# Altium project BEE-1012 PAY-EXP_V12.PrjPcb (part 4 of 4)

## Sheet 17_I2C_Sensor_OnBoard.SchDoc
size 420 x 297 mm; SheetNumber: 28; SheetTotal: 36
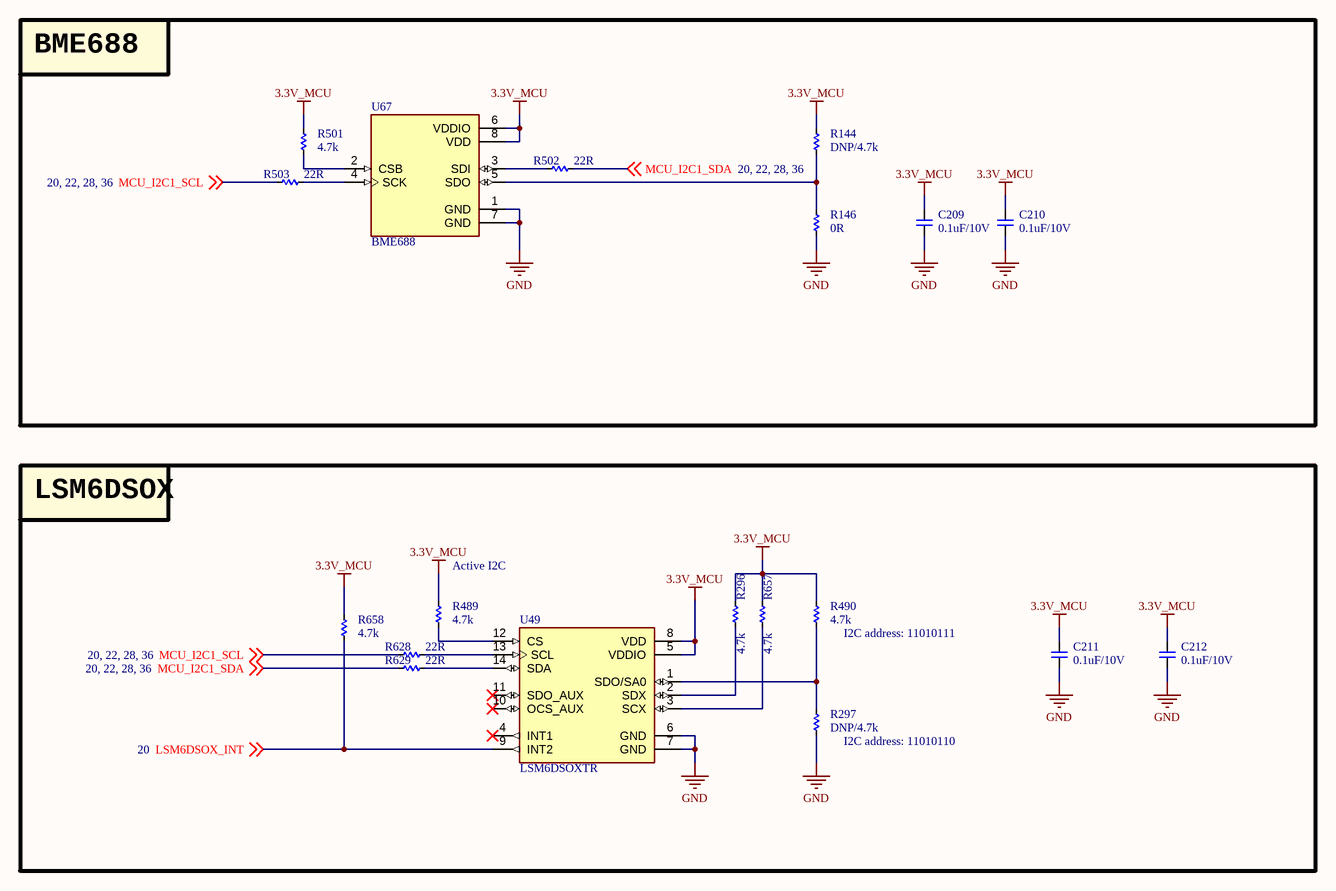
[diagram p28: 17_I2C_Sensor_OnBoard.SchDoc]

### Parts
(Parts that share a designator on the sheet are numbered #1, #2 ... from top to bottom, then left to right.)
C209  0.1uF/10V  [CAP_C_1005X60]
C210  0.1uF/10V  [CAP_C_1005X60]
C211  0.1uF/10V  [CAP_C_1005X60]
C212  0.1uF/10V  [CAP_C_1005X60]
R144#2  DNP/4.7k  [RES_C_1005X40]
R146#2  0R  [RES_C_1005X40]
R296  4.7k  [RES_C_1005X40]
R297  DNP/4.7k  [RES_C_1005X40]
R489  4.7k  [RES_C_1005X40]
R490  4.7k  [RES_C_1005X40]
R501  4.7k  [RES_C_1005X40]
R502  22R  [RES_C_1005X40]
R503  22R  [RES_C_1005X40]
R628  22R  [RES_C_1005X40]
R629  22R  [RES_C_1005X40]
R657  4.7k  [RES_C_1005X40]
R658  4.7k  [RES_C_1005X40]
U49  LSM6DSOXTR  [PQFN50P250X300X86-14N]
U67  BME688  [IC_BME688]

### Blocks framed on the sheet
BME688: C209 C210 R144#2 R146#2 R501-R503 U67
LSM6DSOX: C211 C212 R296 R297 R489 R490 R628 R629 R657 R658 U49

### Nets
3.3V_MCU: C209.2 C210.2 C211.2 C212.2 R144#2.1 R296.1 R489.1 R490.1 R501.1 R657.1 R658.1 U49.5(VDDIO) U49.8(VDD) U67.6(VDDIO) U67.8(VDD)
GND: C209.1 C210.1 C211.1 C212.1 R146#2.2 R297.2 U49.6(GND) U49.7(GND) U67.1(GND) U67.7(GND)
LSM6DSOX_INT: R658.2 U49.9(INT2) ; off-sheet LSM6DSOX_INT
MCU_I2C1_SCL: R503.1 R628.1 ; off-sheet MCU_I2C1_SCL
MCU_I2C1_SDA: R502.2 R629.1 ; off-sheet MCU_I2C1_SDA
NetR144#2_2: R144#2.2 R146#2.1 U67.5(SDO)
NetR296_2: R296.2 U49.2(SDX)
NetR297_1: R297.1 R490.2 U49.1(SDO/SA0)
NetR489_2: R489.2 U49.12(CS)
NetR501_2: R501.2 U67.2(CSB)
NetR502_1: R502.1 U67.3(SDI)
NetR503_2: R503.2 U67.4(SCK)
NetR628_2: R628.2 U49.13(SCL)
NetR629_2: R629.2 U49.14(SDA)
NetR657_2: R657.2 U49.3(SCX)

Not connected (* = marked no-connect by the designer): U49 4(INT1)* 10(OCS_AUX)* 11(SDO_AUX)*

### Notes on the sheet
- (near R489) Active I2C
- (near R490) I2C address: 11010111
- (near R297) I2C address: 11010110
- Project:
- Sub-system:
- Design by:
- Sheet title:
- Sheet
- of
- Checked by:
- Approved by:
- Revision:
- Document No:
- Size:
- Date:
- A3

### Library data of the parts
C209-C212 = _CAP_C_2: CAP
R144#2 R146#2 R296 R297 R489 R490 R501-R503 R628 R629 R657 R658 = _RES_B_2: RES
U49 = LSM6DSOXTR: Accelerometer, Gyroscope, 6 Axis Sensor I2C, SPI Output; MF: STMicroelectronics; SnapEDA_Link: https://www.snapeda.com/parts/LSM6DSOXTR/STMicroelectronics/view-part/?ref=snap; Package: VFLGA-14 STMicroelectronics; Value: *; MP: LSM6DSOXTR; Check_prices: https://www.snapeda.com/parts/LSM6DSOXTR/STMicroelectronics/view-part/?ref=eda
U67 = BME688: Gas sensor measuring relative humidity, barometric pressure, ambient temperature and gas (VOC); Package: None; MP: BME688; Price: None; Availability: Unavailable; Value: *

## Sheet 18_HD4_PUMP.SchDoc
size 420 x 297 mm; SheetNumber: 29; SheetTotal: 36
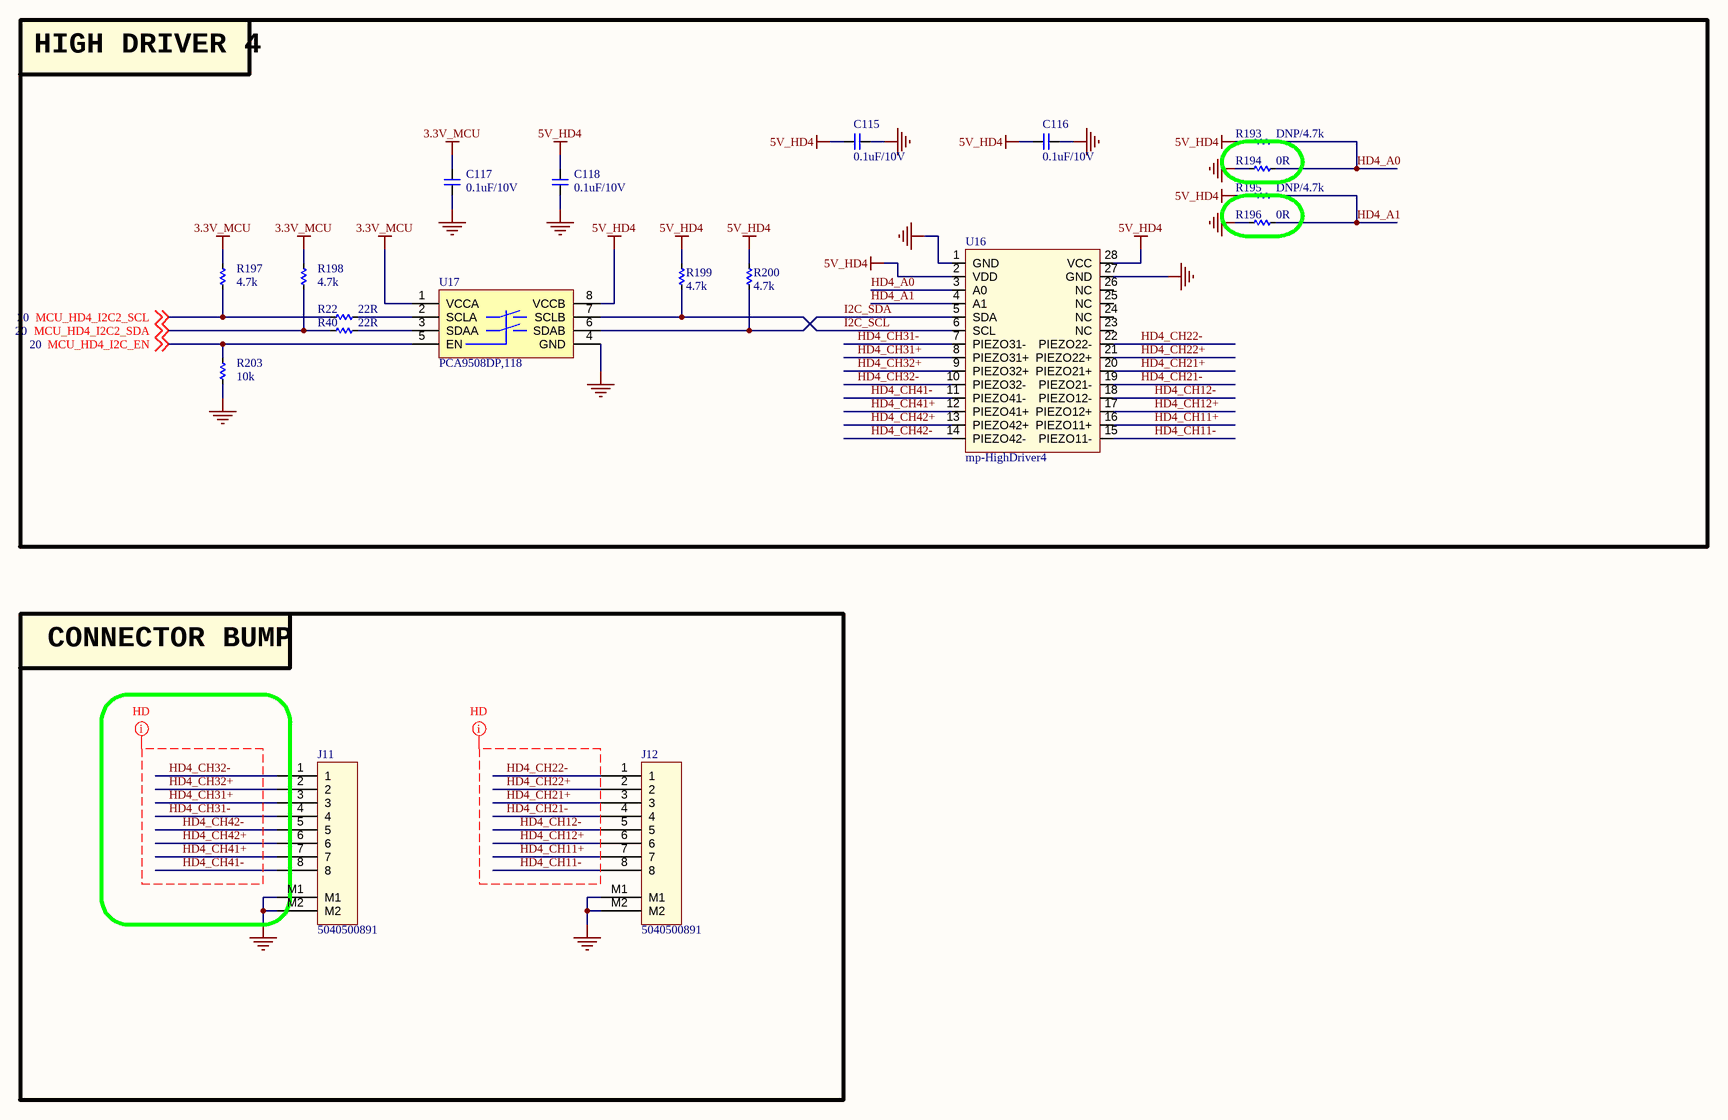
[diagram p29: 18_HD4_PUMP.SchDoc]

### Parts
C115  0.1uF/10V  [CAP_C_1005X60]
C116  0.1uF/10V  [CAP_C_1005X60]
C117  0.1uF/10V  [CAP_C_1005X60]
C118  0.1uF/10V  [CAP_C_1005X60]
J11  5040500891  [MOLEX_5040500891]
J12  5040500891  [MOLEX_5040500891]
R22  22R  [RES_C_1005X40]
R40  22R  [RES_C_1005X40]
R193  DNP/4.7k  [RES_C_1005X40]
R194  0R  [RES_C_1005X40]
R195  DNP/4.7k  [RES_C_1005X40]
R196  0R  [RES_C_1005X40]
R197  4.7k  [RES_C_1005X40]
R198  4.7k  [RES_C_1005X40]
R199  4.7k  [RES_C_1005X40]
R200  4.7k  [RES_C_1005X40]
R203  10k  [RES_C_1005X40]
U16  mp-HighDriver4  [MP_HIGHDRIVER4]
U17  PCA9508DP,118  [TSOP8]

### Blocks framed on the sheet
HIGH DRIVER 4: C115-C118 R22 R40 R193-R200 R203 U16 U17
CONNECTOR BUMP: J11 J12

### Nets
3.3V_MCU: C117.2 R197.1 R198.1 U17.1(VCCA)
5V_HD4: C115.2 C116.2 C118.2 R193.1 R195.1 R199.1 R200.1 U16.2(VDD) U16.28(VCC) U17.8(VCCB)
GND: C115.1 C116.1 C117.1 C118.1 J11.M1 J11.M2 J12.M1 J12.M2 R194.1 R196.1 R203.2 U16.1(GND) U16.27(GND) U17.4(GND)
HD4_A0: R193.2 R194.2 U16.3(A0)
HD4_A1: R195.2 R196.2 U16.4(A1)
HD4_CH11+: J12.7 U16.16(PIEZO11+)
HD4_CH11-: J12.8 U16.15(PIEZO11-)
HD4_CH12+: J12.6 U16.17(PIEZO12+)
HD4_CH12-: J12.5 U16.18(PIEZO12-)
HD4_CH21+: J12.3 U16.20(PIEZO21+)
HD4_CH21-: J12.4 U16.19(PIEZO21-)
HD4_CH22+: J12.2 U16.21(PIEZO22+)
HD4_CH22-: J12.1 U16.22(PIEZO22-)
HD4_CH31+: J11.3 U16.8(PIEZO31+)
HD4_CH31-: J11.4 U16.7(PIEZO31-)
HD4_CH32+: J11.2 U16.9(PIEZO32+)
HD4_CH32-: J11.1 U16.10(PIEZO32-)
HD4_CH41+: J11.7 U16.12(PIEZO41+)
HD4_CH41-: J11.8 U16.11(PIEZO41-)
HD4_CH42+: J11.6 U16.13(PIEZO42+)
HD4_CH42-: J11.5 U16.14(PIEZO42-)
I2C_SCL: R199.2 U16.6(SCL) U17.7(SCLB)
I2C_SDA: R200.2 U16.5(SDA) U17.6(SDAB)
MCU_HD4_I2C2_SCL: R22.1 R197.2 ; off-sheet MCU_HD4_I2C2_SCL
MCU_HD4_I2C2_SDA: R40.1 R198.2 ; off-sheet MCU_HD4_I2C2_SDA
MCU_HD4_I2C_EN: R203.1 U17.5(EN) ; off-sheet MCU_HD4_I2C_EN
NetR22_2: R22.2 U17.2(SCLA)
NetR40_2: R40.2 U17.3(SDAA)

Not connected (* = marked no-connect by the designer): U16 23(NC) 24(NC) 25(NC) 26(NC)

### Layout directives
net class HD: HD4_CH11+, HD4_CH11-, HD4_CH12+, HD4_CH12-, HD4_CH21+, HD4_CH21-, HD4_CH22+, HD4_CH22-, HD4_CH31+, HD4_CH31-, HD4_CH32+, HD4_CH32-, HD4_CH41+, HD4_CH41-, HD4_CH42+, HD4_CH42-

### Notes on the sheet
- Project:
- Sub-system:
- Design by:
- Sheet title:
- Sheet
- of
- Checked by:
- Approved by:
- Revision:
- Document No:
- Size:
- Date:
- A3

### Library data of the parts
C115-C118 = _CAP_C_2: CAP
J11 J12 = Header 8x1_2M
R22 R40 R193-R200 R203 = _RES_B_2: RES
U16 = mp_HighDriver4

## Sheet 18_HD4_PUMP_2.SchDoc
size 420 x 297 mm; SheetNumber: 30; SheetTotal: 36
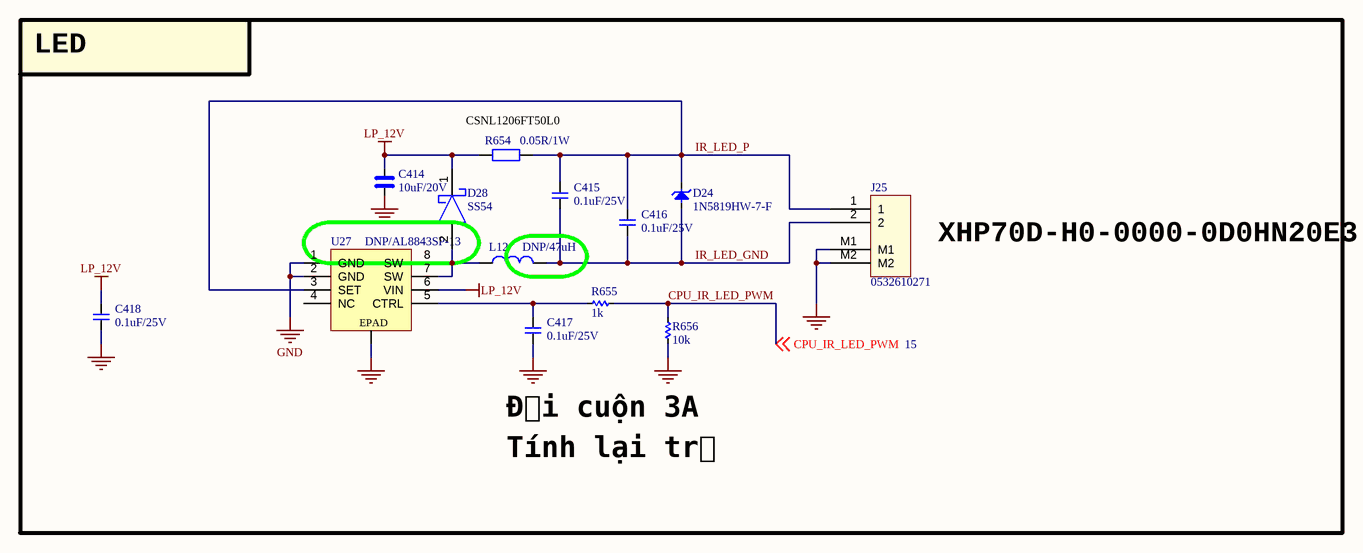
[diagram p30: 18_HD4_PUMP_2.SchDoc]

### Parts
C414  10uF/20V  [CAP_C_2012X110]
C415  0.1uF/25V  [CAP_C_1608X80]
C416  0.1uF/25V  [CAP_C_1608X80]
C417  0.1uF/25V  [CAP_C_1608X80]
C418  0.1uF/25V  [CAP_C_1608X80]
D24  1N5819HW-7-F  [SOD3717X145N]
D28  SS54  [DO-214AC_SMA]
J25  0532610271  [MOLEX_5040500291]
L12  DNP/47uH  [IND_MP_1250x1250x850]
R654  0.05R/1W  [RES_C_3216X70]
R655  1k  [RES_C_1608X60]
R656  10k  [RES_C_1608X60]
U27  DNP/AL8843SP-13  [SOIC127P602X173-8N_EPAD]

### Nets
GND: C414.2 C417.1 C418.1 J25.M1 J25.M2 R656.2 U27.1(GND) U27.2(GND) U27.9(EPAD)
LP_12V: C414.1 C418.2 D28.1 R654.1 U27.6(VIN)
CPU_IR_LED_PWM: R655.2 R656.1 ; off-sheet CPU_IR_LED_PWM
IR_LED_GND: C415.1 C416.1 D24.2(A) J25.2 L12.2
IR_LED_P: C415.2 C416.2 D24.1(K) J25.1 R654.2 U27.3(SET)
NetC417_2: C417.2 R655.1 U27.5(CTRL)
NetD28_2: D28.2 L12.1 U27.7(SW) U27.8(SW)

Not connected (* = marked no-connect by the designer): U27 4(NC)

### Notes on the sheet
- LED
- (near R654) CSNL1206FT50L0
- XHP70D-H0-0000-0D0HN20E3
- Đổi cuộn 3A
- Tính lại trở
- Project:
- Sub-system:
- Design by:
- Sheet title:
- Sheet
- of
- Checked by:
- Approved by:
- Revision:
- Document No:
- Size:
- Date:
- A3

### Library data of the parts
C414 = _CAP_C_High_2: CAP High Value
C415-C418 = _CAP_C_2: CAP
D24 = DIODE Zener: Zenner
D28 = SS54: DIODE SCHOTTKY 60V 3A DO214AA
J25 = Header 2x1_2M
L12 = L-SMD-1: B82477P4473M000; partNo: 78477010; Manufacturer: Wurth Elektronik; Inductance: 1.0 μH; ComponentLink1Description: Manufacturer; ComponentLink1URL: http://www.we-online.de; Created by: Baojun Chen; Created Date: Nov.2015; ComponentLink2Description: Datasheet; ComponentLink2URL: http://katalog.we-online.de/pbs/datasheet/78477010.pdf
R654 = _RES: RES; Chung_Loai: Dán; Don_Vi: Con; So_Chan: 2; Ten_Linh_Kien: Trở 0603 1% 10k; Ma_Hang: MH006333; Kieu_Chan: *
R655 R656 = _RES_B_2: RES
U27 = AL8843SP-13: IC LED DRIVER RGLTR PWM 3A 8SO

## Sheet 19_SOLENOID_HB_1.SchDoc
size 420 x 297 mm; SheetNumber: 31; SheetTotal: 36
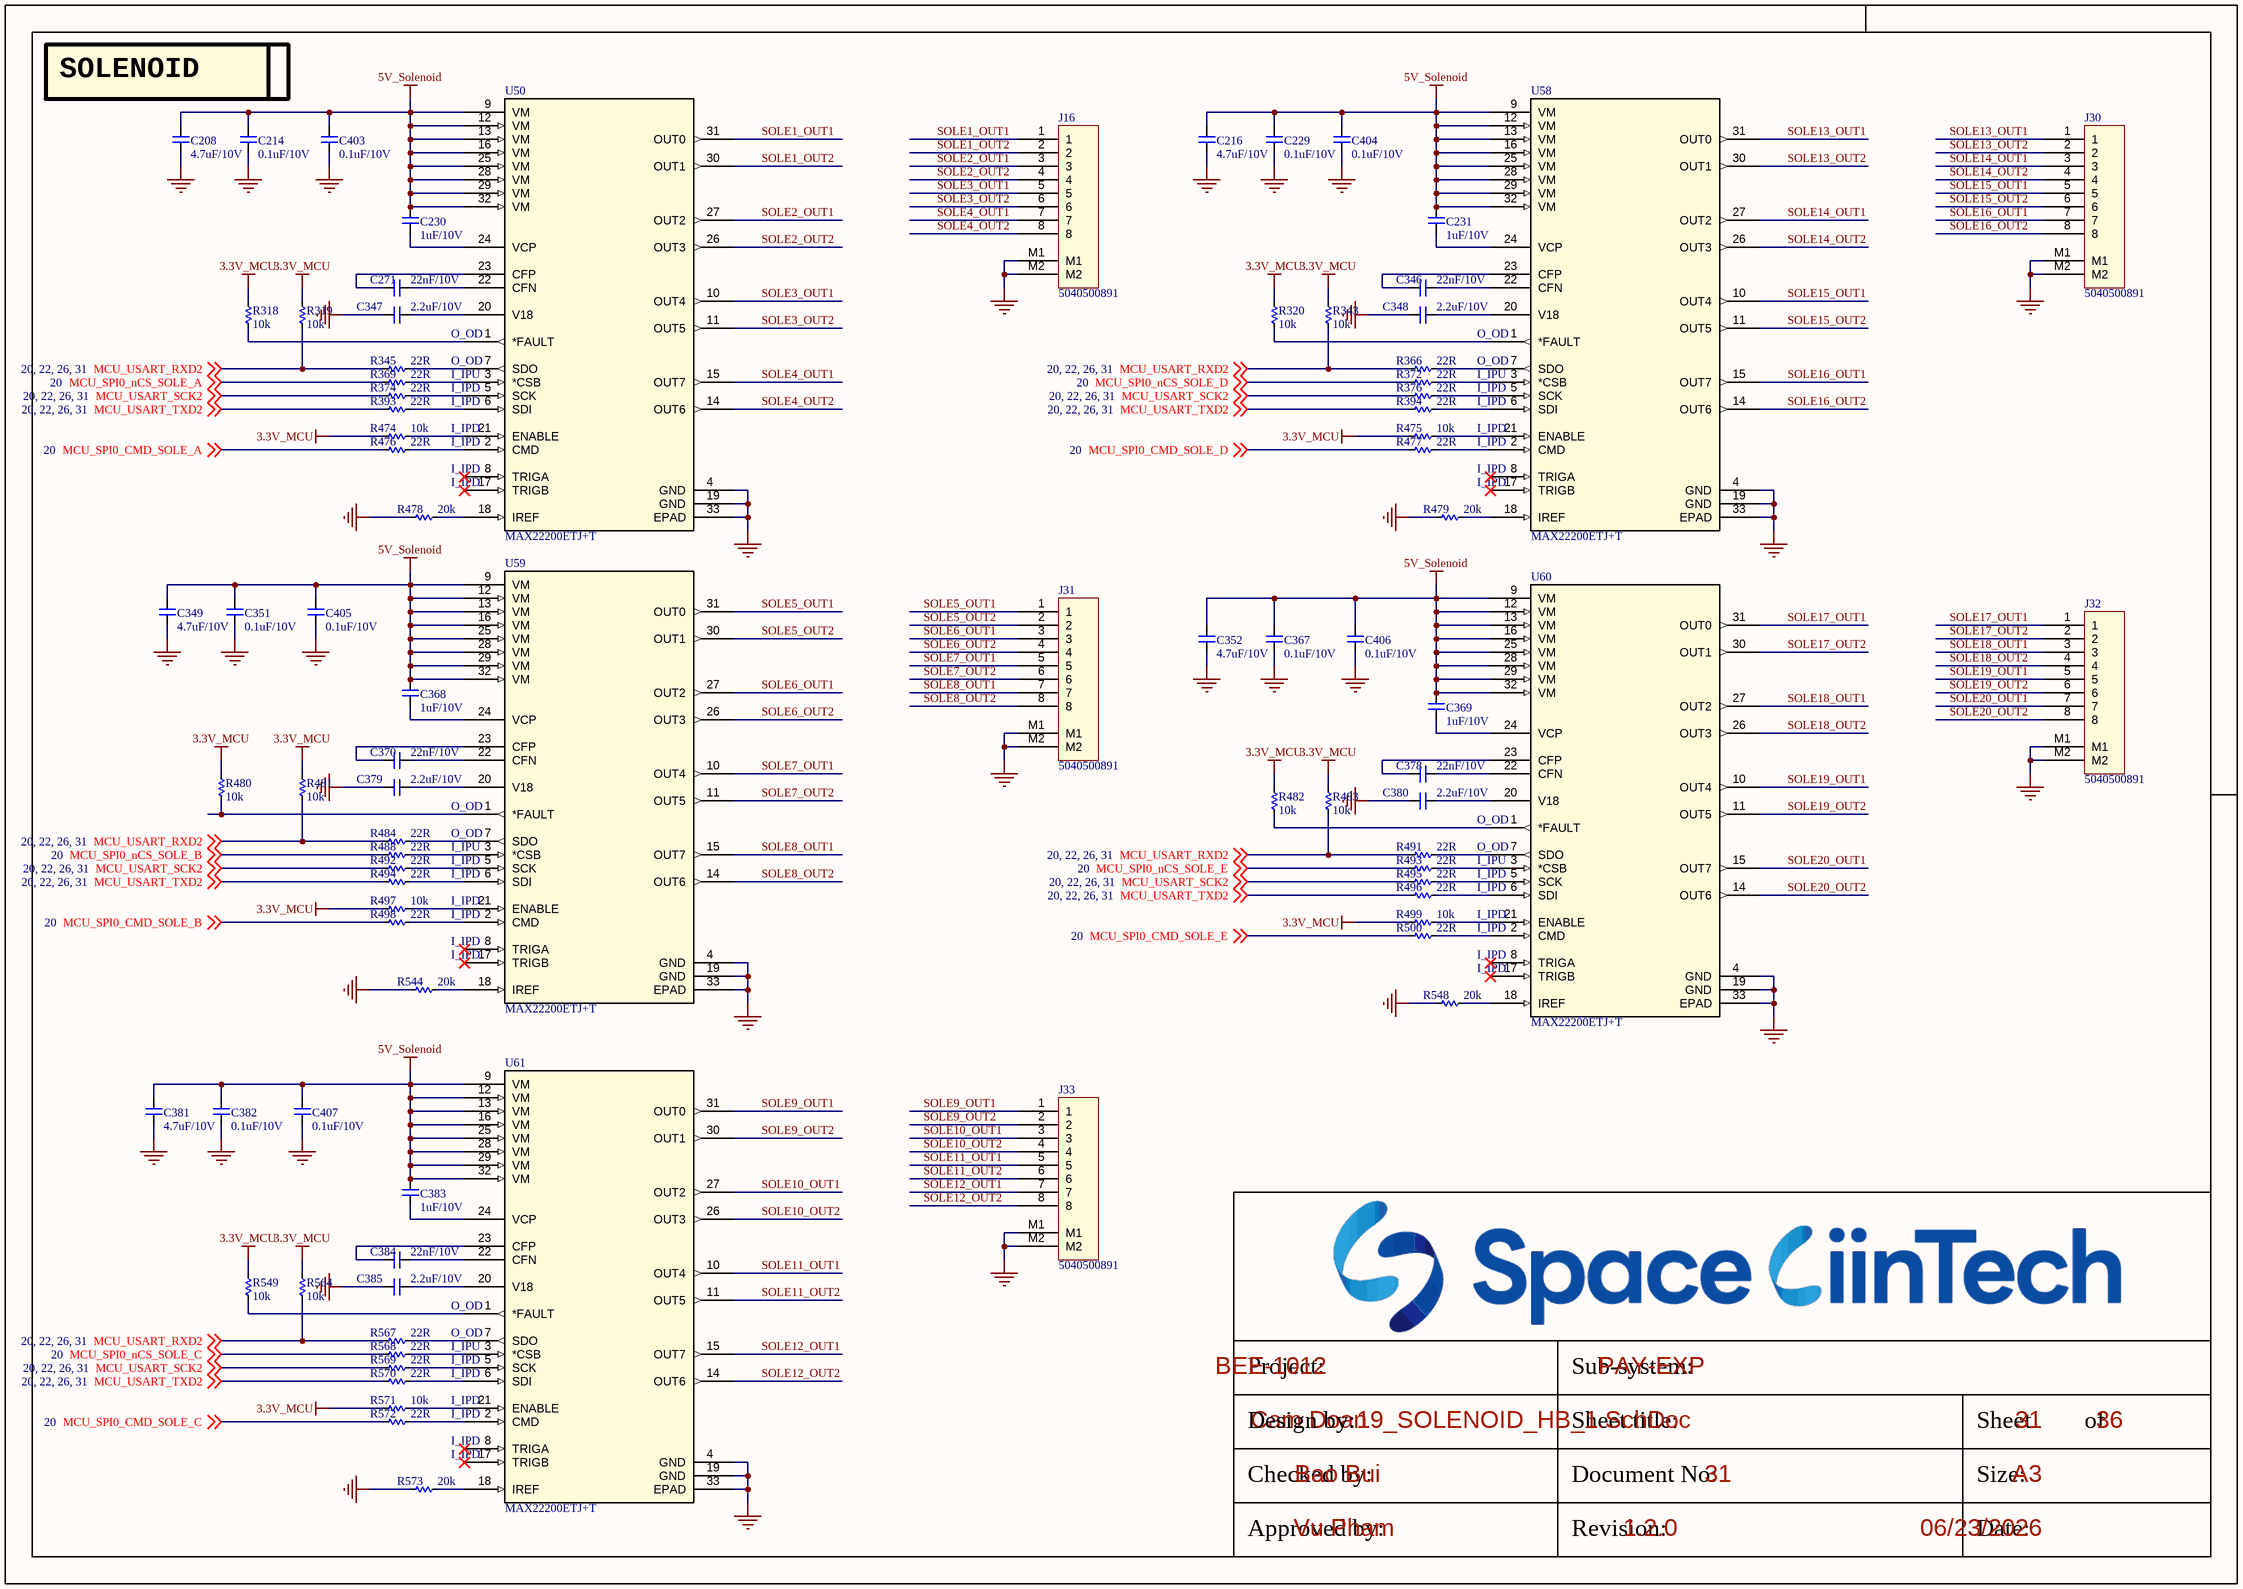
[diagram p31: 19_SOLENOID_HB_1.SchDoc]

### Parts
C208  4.7uF/10V  [CAP_C_1005X60]
C214  0.1uF/10V  [CAP_C_1005X60]
C216  4.7uF/10V  [CAP_C_1005X60]
C229  0.1uF/10V  [CAP_C_1005X60]
C230  1uF/10V  [CAP_C_1005X60]
C231  1uF/10V  [CAP_C_1005X60]
C271  22nF/10V  [CAP_C_1005X60]
C346  22nF/10V  [CAP_C_1005X60]
C347  2.2uF/10V  [CAP_C_1005X60]
C348  2.2uF/10V  [CAP_C_1005X60]
C349  4.7uF/10V  [CAP_C_1005X60]
C351  0.1uF/10V  [CAP_C_1005X60]
C352  4.7uF/10V  [CAP_C_1005X60]
C367  0.1uF/10V  [CAP_C_1005X60]
C368  1uF/10V  [CAP_C_1005X60]
C369  1uF/10V  [CAP_C_1005X60]
C370  22nF/10V  [CAP_C_1005X60]
C378  22nF/10V  [CAP_C_1005X60]
C379  2.2uF/10V  [CAP_C_1005X60]
C380  2.2uF/10V  [CAP_C_1005X60]
C381  4.7uF/10V  [CAP_C_1005X60]
C382  0.1uF/10V  [CAP_C_1005X60]
C383  1uF/10V  [CAP_C_1005X60]
C384  22nF/10V  [CAP_C_1005X60]
C385  2.2uF/10V  [CAP_C_1005X60]
C403  0.1uF/10V  [CAP_C_1005X60]
C404  0.1uF/10V  [CAP_C_1005X60]
C405  0.1uF/10V  [CAP_C_1005X60]
C406  0.1uF/10V  [CAP_C_1005X60]
C407  0.1uF/10V  [CAP_C_1005X60]
J16  5040500891  [MOLEX_5040500891]
J30  5040500891  [MOLEX_5040500891]
J31  5040500891  [MOLEX_5040500891]
J32  5040500891  [MOLEX_5040500891]
J33  5040500891  [MOLEX_5040500891]
R318  10k  [RES_C_1005X40]
R319  10k  [RES_C_1005X40]
R320  10k  [RES_C_1005X40]
R343  10k  [RES_C_1005X40]
R345  22R  [RES_C_1005X40]
R366  22R  [RES_C_1005X40]
R369  22R  [RES_C_1005X40]
R372  22R  [RES_C_1005X40]
R374  22R  [RES_C_1005X40]
R376  22R  [RES_C_1005X40]
R393  22R  [RES_C_1005X40]
R394  22R  [RES_C_1005X40]
R474  10k  [RES_C_1005X40]
R475  10k  [RES_C_1005X40]
R476  22R  [RES_C_1005X40]
R477  22R  [RES_C_1005X40]
R478  20k  [RES_C_1005X40]
R479  20k  [RES_C_1005X40]
R480  10k  [RES_C_1005X40]
R481  10k  [RES_C_1005X40]
R482  10k  [RES_C_1005X40]
R483  10k  [RES_C_1005X40]
R484  22R  [RES_C_1005X40]
R488  22R  [RES_C_1005X40]
R491  22R  [RES_C_1005X40]
R492  22R  [RES_C_1005X40]
R493  22R  [RES_C_1005X40]
R494  22R  [RES_C_1005X40]
R495  22R  [RES_C_1005X40]
R496  22R  [RES_C_1005X40]
R497  10k  [RES_C_1005X40]
R498  22R  [RES_C_1005X40]
R499  10k  [RES_C_1005X40]
R500  22R  [RES_C_1005X40]
R544  20k  [RES_C_1005X40]
R548  20k  [RES_C_1005X40]
R549  10k  [RES_C_1005X40]
R564  10k  [RES_C_1005X40]
R567  22R  [RES_C_1005X40]
R568  22R  [RES_C_1005X40]
R569  22R  [RES_C_1005X40]
R570  22R  [RES_C_1005X40]
R571  10k  [RES_C_1005X40]
R572  22R  [RES_C_1005X40]
R573  20k  [RES_C_1005X40]
U50  MAX22200ETJ+T  [21-0140AK_T3255_8C_MXM]
U58  MAX22200ETJ+T  [21-0140AK_T3255_8C_MXM]
U59  MAX22200ETJ+T  [21-0140AK_T3255_8C_MXM]
U60  MAX22200ETJ+T  [21-0140AK_T3255_8C_MXM]
U61  MAX22200ETJ+T  [21-0140AK_T3255_8C_MXM]

### Nets
3.3V_MCU: R318.1 R319.1 R320.1 R343.1 R474.1 R475.1 R480.1 R481.1 R482.1 R483.1 R497.1 R499.1 R549.1 R564.1 R571.1
5V_Solenoid: C208.2 C214.2 C216.2 C229.2 C230.2 C231.2 C349.2 C351.2 C352.2 C367.2 C368.2 C369.2 C381.2 C382.2 C383.2 C403.2 C404.2 C405.2 C406.2 C407.2 U50.9(VM) U50.12(VM) U50.13(VM) U50.16(VM) U50.25(VM) U50.28(VM) U50.29(VM) U50.32(VM) U58.9(VM) U58.12(VM) U58.13(VM) U58.16(VM) U58.25(VM) U58.28(VM) U58.29(VM) U58.32(VM) U59.9(VM) U59.12(VM) U59.13(VM) U59.16(VM) U59.25(VM) U59.28(VM) U59.29(VM) U59.32(VM) U60.9(VM) U60.12(VM) U60.13(VM) U60.16(VM) U60.25(VM) U60.28(VM) U60.29(VM) U60.32(VM) U61.9(VM) U61.12(VM) U61.13(VM) U61.16(VM) U61.25(VM) U61.28(VM) U61.29(VM) U61.32(VM)
GND: C208.1 C214.1 C216.1 C229.1 C347.1 C348.1 C349.1 C351.1 C352.1 C367.1 C379.1 C380.1 C381.1 C382.1 C385.1 C403.1 C404.1 C405.1 C406.1 C407.1 J16.M1 J16.M2 J30.M1 J30.M2 J31.M1 J31.M2 J32.M1 J32.M2 J33.M1 J33.M2 R478.1 R479.1 R544.1 R548.1 R573.1 U50.4(GND) U50.19(GND) U50.33(EPAD) U58.4(GND) U58.19(GND) U58.33(EPAD) U59.4(GND) U59.19(GND) U59.33(EPAD) U60.4(GND) U60.19(GND) U60.33(EPAD) U61.4(GND) U61.19(GND) U61.33(EPAD)
MCU_SPI0_CMD_SOLE_A: R476.1 ; off-sheet MCU_SPI0_CMD_SOLE_A
MCU_SPI0_CMD_SOLE_B: R498.1 ; off-sheet MCU_SPI0_CMD_SOLE_B
MCU_SPI0_CMD_SOLE_C: R572.1 ; off-sheet MCU_SPI0_CMD_SOLE_C
MCU_SPI0_CMD_SOLE_D: R477.1 ; off-sheet MCU_SPI0_CMD_SOLE_D
MCU_SPI0_CMD_SOLE_E: R500.1 ; off-sheet MCU_SPI0_CMD_SOLE_E
MCU_SPI0_nCS_SOLE_A: R369.1 ; off-sheet MCU_SPI0_nCS_SOLE_A
MCU_SPI0_nCS_SOLE_B: R488.1 ; off-sheet MCU_SPI0_nCS_SOLE_B
MCU_SPI0_nCS_SOLE_C: R568.1 ; off-sheet MCU_SPI0_nCS_SOLE_C
MCU_SPI0_nCS_SOLE_D: R372.1 ; off-sheet MCU_SPI0_nCS_SOLE_D
MCU_SPI0_nCS_SOLE_E: R493.1 ; off-sheet MCU_SPI0_nCS_SOLE_E
MCU_USART_RXD2: R319.2 R343.2 R345.1 R366.1 R481.2 R483.2 R484.1 R491.1 R564.2 R567.1 ; off-sheet MCU_USART_RXD2
MCU_USART_SCK2: R374.1 R376.1 R492.1 R495.1 R569.1 ; off-sheet MCU_USART_SCK2
MCU_USART_TXD2: R393.1 R394.1 R494.1 R496.1 R570.1 ; off-sheet MCU_USART_TXD2
SOLE1_OUT1: J16.1 U50.31(OUT0)
SOLE1_OUT2: J16.2 U50.30(OUT1)
SOLE2_OUT1: J16.3 U50.27(OUT2)
SOLE2_OUT2: J16.4 U50.26(OUT3)
SOLE3_OUT1: J16.5 U50.10(OUT4)
SOLE3_OUT2: J16.6 U50.11(OUT5)
SOLE4_OUT1: J16.7 U50.15(OUT7)
SOLE4_OUT2: J16.8 U50.14(OUT6)
SOLE5_OUT1: J31.1 U59.31(OUT0)
SOLE5_OUT2: J31.2 U59.30(OUT1)
SOLE6_OUT1: J31.3 U59.27(OUT2)
SOLE6_OUT2: J31.4 U59.26(OUT3)
SOLE7_OUT1: J31.5 U59.10(OUT4)
SOLE7_OUT2: J31.6 U59.11(OUT5)
SOLE8_OUT1: J31.7 U59.15(OUT7)
SOLE8_OUT2: J31.8 U59.14(OUT6)
SOLE9_OUT1: J33.1 U61.31(OUT0)
SOLE9_OUT2: J33.2 U61.30(OUT1)
SOLE10_OUT1: J33.3 U61.27(OUT2)
SOLE10_OUT2: J33.4 U61.26(OUT3)
SOLE11_OUT1: J33.5 U61.10(OUT4)
SOLE11_OUT2: J33.6 U61.11(OUT5)
SOLE12_OUT1: J33.7 U61.15(OUT7)
SOLE12_OUT2: J33.8 U61.14(OUT6)
SOLE13_OUT1: J30.1 U58.31(OUT0)
SOLE13_OUT2: J30.2 U58.30(OUT1)
SOLE14_OUT1: J30.3 U58.27(OUT2)
SOLE14_OUT2: J30.4 U58.26(OUT3)
SOLE15_OUT1: J30.5 U58.10(OUT4)
SOLE15_OUT2: J30.6 U58.11(OUT5)
SOLE16_OUT1: J30.7 U58.15(OUT7)
SOLE16_OUT2: J30.8 U58.14(OUT6)
SOLE17_OUT1: J32.1 U60.31(OUT0)
SOLE17_OUT2: J32.2 U60.30(OUT1)
SOLE18_OUT1: J32.3 U60.27(OUT2)
SOLE18_OUT2: J32.4 U60.26(OUT3)
SOLE19_OUT1: J32.5 U60.10(OUT4)
SOLE19_OUT2: J32.6 U60.11(OUT5)
SOLE20_OUT1: J32.7 U60.15(OUT7)
SOLE20_OUT2: J32.8 U60.14(OUT6)
NetC230_1: C230.1 U50.24(VCP)
NetC231_1: C231.1 U58.24(VCP)
NetC271_1: C271.1 U50.22(CFN)
NetC271_2: C271.2 U50.23(CFP)
NetC346_1: C346.1 U58.22(CFN)
NetC346_2: C346.2 U58.23(CFP)
NetC347_2: C347.2 U50.20(V18)
NetC348_2: C348.2 U58.20(V18)
NetC368_1: C368.1 U59.24(VCP)
NetC369_1: C369.1 U60.24(VCP)
NetC370_1: C370.1 U59.22(CFN)
NetC370_2: C370.2 U59.23(CFP)
NetC378_1: C378.1 U60.22(CFN)
NetC378_2: C378.2 U60.23(CFP)
NetC379_2: C379.2 U59.20(V18)
NetC380_2: C380.2 U60.20(V18)
NetC383_1: C383.1 U61.24(VCP)
NetC384_1: C384.1 U61.22(CFN)
NetC384_2: C384.2 U61.23(CFP)
NetC385_2: C385.2 U61.20(V18)
NetR318_2: R318.2 U50.1(*FAULT)
NetR320_2: R320.2 U58.1(*FAULT)
NetR345_2: R345.2 U50.7(SDO)
NetR366_2: R366.2 U58.7(SDO)
NetR369_2: R369.2 U50.3(*CSB)
NetR372_2: R372.2 U58.3(*CSB)
NetR374_2: R374.2 U50.5(SCK)
NetR376_2: R376.2 U58.5(SCK)
NetR393_2: R393.2 U50.6(SDI)
NetR394_2: R394.2 U58.6(SDI)
NetR474_2: R474.2 U50.21(ENABLE)
NetR475_2: R475.2 U58.21(ENABLE)
NetR476_2: R476.2 U50.2(CMD)
NetR477_2: R477.2 U58.2(CMD)
NetR478_2: R478.2 U50.18(IREF)
NetR479_2: R479.2 U58.18(IREF)
NetR480_2: R480.2 U59.1(*FAULT)
NetR482_2: R482.2 U60.1(*FAULT)
NetR484_2: R484.2 U59.7(SDO)
NetR488_2: R488.2 U59.3(*CSB)
NetR491_2: R491.2 U60.7(SDO)
NetR492_2: R492.2 U59.5(SCK)
NetR493_2: R493.2 U60.3(*CSB)
NetR494_2: R494.2 U59.6(SDI)
NetR495_2: R495.2 U60.5(SCK)
NetR496_2: R496.2 U60.6(SDI)
NetR497_2: R497.2 U59.21(ENABLE)
NetR498_2: R498.2 U59.2(CMD)
NetR499_2: R499.2 U60.21(ENABLE)
NetR500_2: R500.2 U60.2(CMD)
NetR544_2: R544.2 U59.18(IREF)
NetR548_2: R548.2 U60.18(IREF)
NetR549_2: R549.2 U61.1(*FAULT)
NetR567_2: R567.2 U61.7(SDO)
NetR568_2: R568.2 U61.3(*CSB)
NetR569_2: R569.2 U61.5(SCK)
NetR570_2: R570.2 U61.6(SDI)
NetR571_2: R571.2 U61.21(ENABLE)
NetR572_2: R572.2 U61.2(CMD)
NetR573_2: R573.2 U61.18(IREF)

Not connected (* = marked no-connect by the designer): U50 8(TRIGA)* 17(TRIGB)*; U58 8(TRIGA)* 17(TRIGB)*; U59 8(TRIGA)* 17(TRIGB)*; U60 8(TRIGA)* 17(TRIGB)*; U61 8(TRIGA)* 17(TRIGB)*

### Notes on the sheet
- (near C208) SOLENOID
- O_OD
- (near U50) I_IPU
- (near U50) I_IPD
- (near U50) O_OD
- (near U58) I_IPU
- (near U58) I_IPD
- (near U58) O_OD
- I_IPD
- (near U59) I_IPU
- (near U59) I_IPD
- (near U59) O_OD
- (near U60) I_IPU
- (near U60) O_OD
- (near U60) I_IPD
- (near U61) O_OD
- (near U61) I_IPU
- (near U61) I_IPD
- Project:
- Sub-system:
- Design by:
- Sheet title:
- Sheet
- of
- Checked by:
- Approved by:
- Revision:
- Document No:
- Size:
- Date:
- A3

### Library data of the parts
C208 C214 C216 C229-C231 C271 C346-C349 C351 C352 C367-C370 C378-C385 C403-C407 = _CAP_C_2: CAP CHIP
J16 J30-J33 = Header 8x1_2M
R318-R320 R343 R345 R366 R369 R372 R374 R376 R393 R394 R474-R484 R488 R491-R500 R544 R548 R549 R564 R567-R573 = _RES_B_2: RES
U50 U58-U61 = MAX22200ETJ+T: 36V, 1A Octal Integrated Serial-Controlled Solenoid and Motor Driver; Manufacturer_Name: Analog Devices Inc; Copyright: Copyright (C) 2026 Ultra Librarian. All rights reserved.; Manufacturer_Part_Number: MAX22200ETJ+T; RefDes: RefDes; Type: Type

## Sheet 19_SOLENOID_OF.SchDoc
size 420 x 297 mm; SheetNumber: 33; SheetTotal: 36
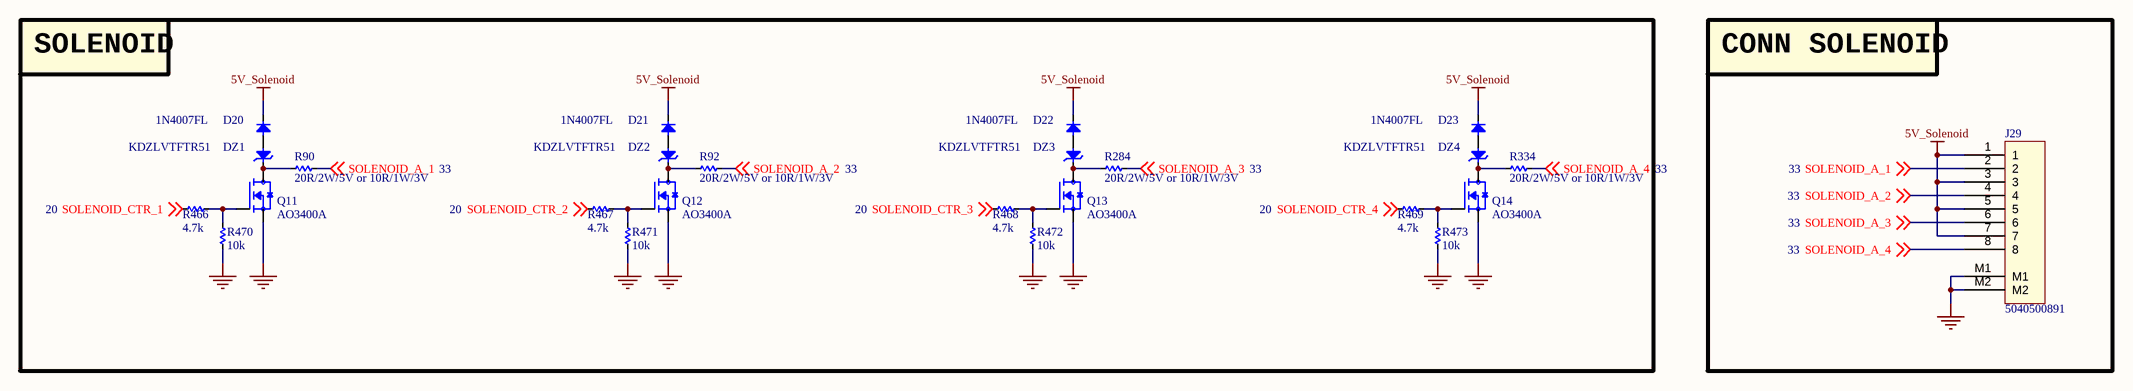
[diagram p32: 19_SOLENOID_OF.SchDoc]

### Parts
D20  1N4007FL  [SOD3717X145N]
D21  1N4007FL  [SOD3717X145N]
D22  1N4007FL  [SOD3717X145N]
D23  1N4007FL  [SOD3717X145N]
DZ1  KDZLVTFTR51  [SOD3717X145N]
DZ2  KDZLVTFTR51  [SOD3717X145N]
DZ3  KDZLVTFTR51  [SOD3717X145N]
DZ4  KDZLVTFTR51  [SOD3717X145N]
J29  5040500891  [MOLEX_5040500891]
Q11  AO3400A  [SOT95P240X120-3N]
Q12  AO3400A  [SOT95P240X120-3N]
Q13  AO3400A  [SOT95P240X120-3N]
Q14  AO3400A  [SOT95P240X120-3N]
R90  20R/2W/5V or 10R/1W/3V  [RES_C_6331X65_N]
R92  20R/2W/5V or 10R/1W/3V  [RES_C_6331X65_N]
R284  20R/2W/5V or 10R/1W/3V  [RES_C_6331X65_N]
R334  20R/2W/5V or 10R/1W/3V  [RES_C_6331X65_N]
R466  4.7k  [RES_C_1005X40]
R467  4.7k  [RES_C_1005X40]
R468  4.7k  [RES_C_1005X40]
R469  4.7k  [RES_C_1005X40]
R470  10k  [RES_C_1005X40]
R471  10k  [RES_C_1005X40]
R472  10k  [RES_C_1005X40]
R473  10k  [RES_C_1005X40]

### Blocks framed on the sheet
SOLENOID: D20-D23 DZ1-DZ4 Q11-Q14 R90 R92 R284 R334 R466-R473
CONN SOLENOID: J29

### Nets
5V_Solenoid: D20.1(K) D21.1(K) D22.1(K) D23.1(K) J29.1 J29.3 J29.5 J29.7
GND: J29.M1 J29.M2 Q11.2(S) Q12.2(S) Q13.2(S) Q14.2(S) R470.1 R471.1 R472.1 R473.1
SOLENOID_A_1: J29.2 R90.1 ; off-sheet SOLENOID_A_1
SOLENOID_A_2: J29.4 R92.1 ; off-sheet SOLENOID_A_2
SOLENOID_A_3: J29.6 R284.1 ; off-sheet SOLENOID_A_3
SOLENOID_A_4: J29.8 R334.1 ; off-sheet SOLENOID_A_4
SOLENOID_CTR_1: R466.2 ; off-sheet SOLENOID_CTR_1
SOLENOID_CTR_2: R467.2 ; off-sheet SOLENOID_CTR_2
SOLENOID_CTR_3: R468.2 ; off-sheet SOLENOID_CTR_3
SOLENOID_CTR_4: R469.2 ; off-sheet SOLENOID_CTR_4
NetD20_2: D20.2(A) DZ1.2(A)
NetD21_2: D21.2(A) DZ2.2(A)
NetD22_2: D22.2(A) DZ3.2(A)
NetD23_2: D23.2(A) DZ4.2(A)
NetDZ1_1: DZ1.1(K) Q11.3(D) R90.2
NetDZ2_1: DZ2.1(K) Q12.3(D) R92.2
NetDZ3_1: DZ3.1(K) Q13.3(D) R284.2
NetDZ4_1: DZ4.1(K) Q14.3(D) R334.2
NetQ11_1: Q11.1(G) R466.1 R470.2
NetQ12_1: Q12.1(G) R467.1 R471.2
NetQ13_1: Q13.1(G) R468.1 R472.2
NetQ14_1: Q14.1(G) R469.1 R473.2

### Notes on the sheet
- Project:
- Sub-system:
- Design by:
- Sheet title:
- Sheet
- of
- Checked by:
- Approved by:
- Revision:
- Document No:
- Size:
- Date:
- A3

### Library data of the parts
D20-D23 = Diode SMD: Default Diode; Code - JEDEC: DO-214-AB; Value: 1N5007; Published: 8-Jun-2000; Revision: July-2002: Re-released for DXP Platform.; Publisher: Altium Limited
DZ1-DZ4 = DIODE Zener: Zenner
J29 = Header 8x1_2M
Q11-Q14 = MOSFET_N: N-Channel 30 V 5.7A (Ta) 1.4W (Ta) Surface Mount SOT-23-3; MF: Alpha & Omega Semiconductor; SnapEDA_Link: https://www.snapeda.com/parts/AO3400A/Alpha/view-part/?ref=snap; Package: SOT-23 Alpha &amp; Omega Semiconductor Inc.; Value: *; MP: AO3400A; Check_prices: https://www.snapeda.com/parts/AO3400A/Alpha/view-part/?ref=eda
R90 R92 R284 R334 R466-R473 = _RES_B_2: RES

## Sheet 20_AI_Board.SchDoc
size 420 x 297 mm; SheetNumber: 33; SheetTotal: 36
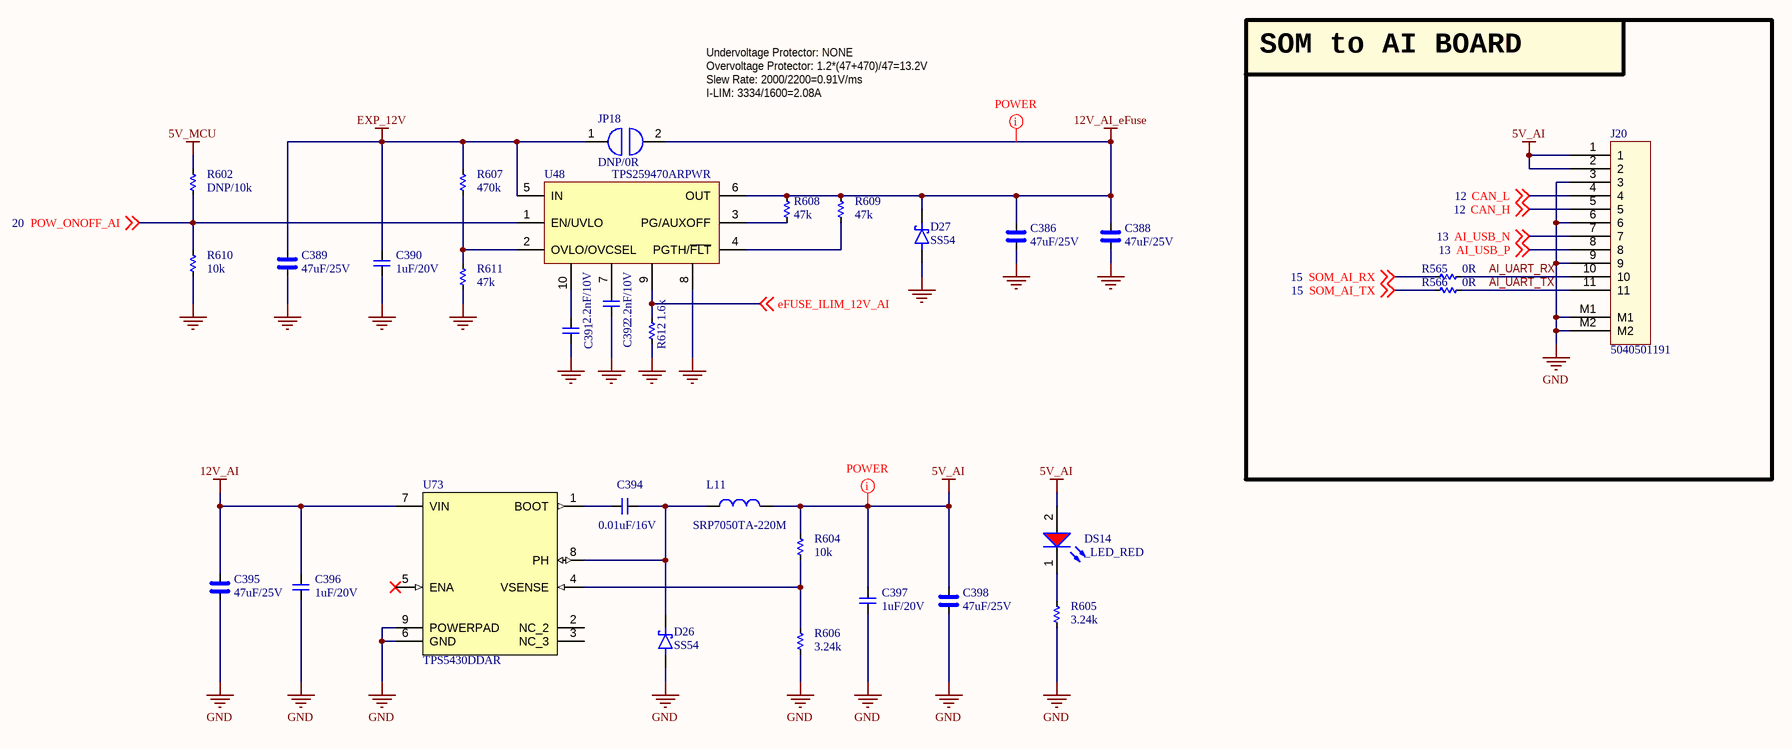
[diagram p33: 20_AI_Board.SchDoc]

### Parts
C386  47uF/25V  [CAP_C_3225X80]
C388  47uF/25V  [CAP_C_3225X80]
C389  47uF/25V  [CAP_C_3225X80]
C390  1uF/20V  [CAP_C_1005X60]
C391  2.2nF/10V  [CAP_C_1005X60]
C392  2.2nF/10V  [CAP_C_1005X60]
C394  0.01uF/16V  [CAP_C_1608X80]
C395  47uF/25V  [CAP_C_3225X80]
C396  1uF/20V  [CAP_C_1005X60]
C397  1uF/20V  [CAP_C_1005X60]
C398  47uF/25V  [CAP_C_3225X80]
D26  SS54  [DO-214AC_SMA]
D27  SS54  [DO-214AC_SMA]
DS14  _LED_RED  [LED_0603]
J20  5040501191  [MOLEX_5040501191]
JP18  DNP/0R  [JUMPER_1608]
L11  SRP7050TA-220M  [PSM6050]
R565  0R  [RES_C_1005X40]
R566  0R  [RES_C_1005X40]
R602  DNP/10k  [RES_C_1005X40]
R604  10k  [RES_C_1005X40]
R605  3.24k  [RES_C_1005X40]
R606  3.24k  [RES_C_1005X40]
R607  470k  [RES_C_1005X40]
R608  47k  [RES_C_1005X40]
R609  47k  [RES_C_1005X40]
R610  10k  [RES_C_1005X40]
R611  47k  [RES_C_1005X40]
R612  1.6k  [RES_C_1005X40]
U48  TPS259470ARPWR  [VQFN-HR-10]
U73  TPS5430DDAR  [TPS54531DDAR]

### Blocks framed on the sheet
SOM to AI BOARD: J20 R565 R566

### Nets
5V_AI: C397.2 C398.2 DS14.2(A) J20.1 J20.2 L11.2 R604.2
5V_MCU: R602.1
12V_AI: C395.2 C396.2 U73.7(VIN)
12V_AI_eFuse: C386.2 C388.2 D27.1(K) JP18.2 R608.2 R609.2 U48.6(OUT)
EXP_12V: C389.2 C390.2 JP18.1 R607.2 U48.5(IN)
GND: C386.1 C388.1 C389.1 C390.1 C391.1 C392.1 C395.1 C396.1 C397.1 C398.1 D26.2(A) D27.2(A) J20.3 J20.6 J20.9 J20.M1 J20.M2 R605.1 R606.1 R610.2 R611.1 R612.1 U48.8 U73.6(GND) U73.9(POWERPAD)
AI_UART_RX: J20.10 R565.2
AI_UART_TX: J20.11 R566.2
AI_USB_N: J20.7 ; off-sheet AI_USB_N  [project net USBB_N]
AI_USB_P: J20.8 ; off-sheet AI_USB_P  [project net USBB_P]
CAN_H: J20.5 ; off-sheet CAN_H
CAN_L: J20.4 ; off-sheet CAN_L
eFUSE_ILIM_12V_AI: R612.2 U48.9 ; off-sheet eFUSE_ILIM_12V_AI
POW_ONOFF_AI: R602.2 R610.1 U48.1(EN/UVLO) ; off-sheet POW_ONOFF_AI
SOM_AI_RX: R565.1 ; off-sheet SOM_AI_RX
SOM_AI_TX: R566.1 ; off-sheet SOM_AI_TX
NetC391_2: C391.2 U48.10
NetC392_2: C392.2 U48.7
NetC394_1: C394.1 D26.1(K) L11.1 U73.8(PH)
NetC394_2: C394.2 U73.1(BOOT)
NetDS14_1: DS14.1(K) R605.2
NetR604_1: R604.1 R606.2 U73.4(VSENSE)
NetR607_1: R607.1 R611.2 U48.2(OVLO/OVCSEL)
NetR608_1: R608.1 U48.3(PG/AUXOFF)
NetR609_1: R609.1 U48.4(PGTH/~{FLT})

Not connected (* = marked no-connect by the designer): U73 2(NC_2) 3(NC_3) 5(ENA)*

### Layout directives
net class POWER: 5V_AI, 12V_AI_eFuse

### Notes on the sheet
- Undervoltage Protector: NONE
- Overvoltage Protector: 1.2*(47+470)/47=13.2V
- Slew Rate: 2000/2200=0.91V/ms
- I-LIM: 3334/1600=2.08A
- Project:
- Sub-system:
- Design by:
- Sheet title:
- Sheet
- of
- Checked by:
- Approved by:
- Revision:
- Document No:
- Size:
- Date:
- A3

### Library data of the parts
C386 C388 C389 C395 C398 = _CAP_C_High_2: CAP High Value
C390-C392 C394 C396 C397 = _CAP_C_2: CAP
D26 D27 = DIODE SCHOTTKY
J20 = Header 11x1_2M
JP18 = JUMPER
L11 = SRP7050TA-220M: FIXED IND 22UH 2.5A 170 MOHM SMD
R565 R566 R602 R604-R612 = _RES_B_2: RES
U73 = TPS5430DDAR: IC REG BUCK ADJ 3A 8SOPWR

## Sheet 21_POWER_PWR_SEN.SchDoc
size 420 x 297 mm; SheetNumber: 34; SheetTotal: 36
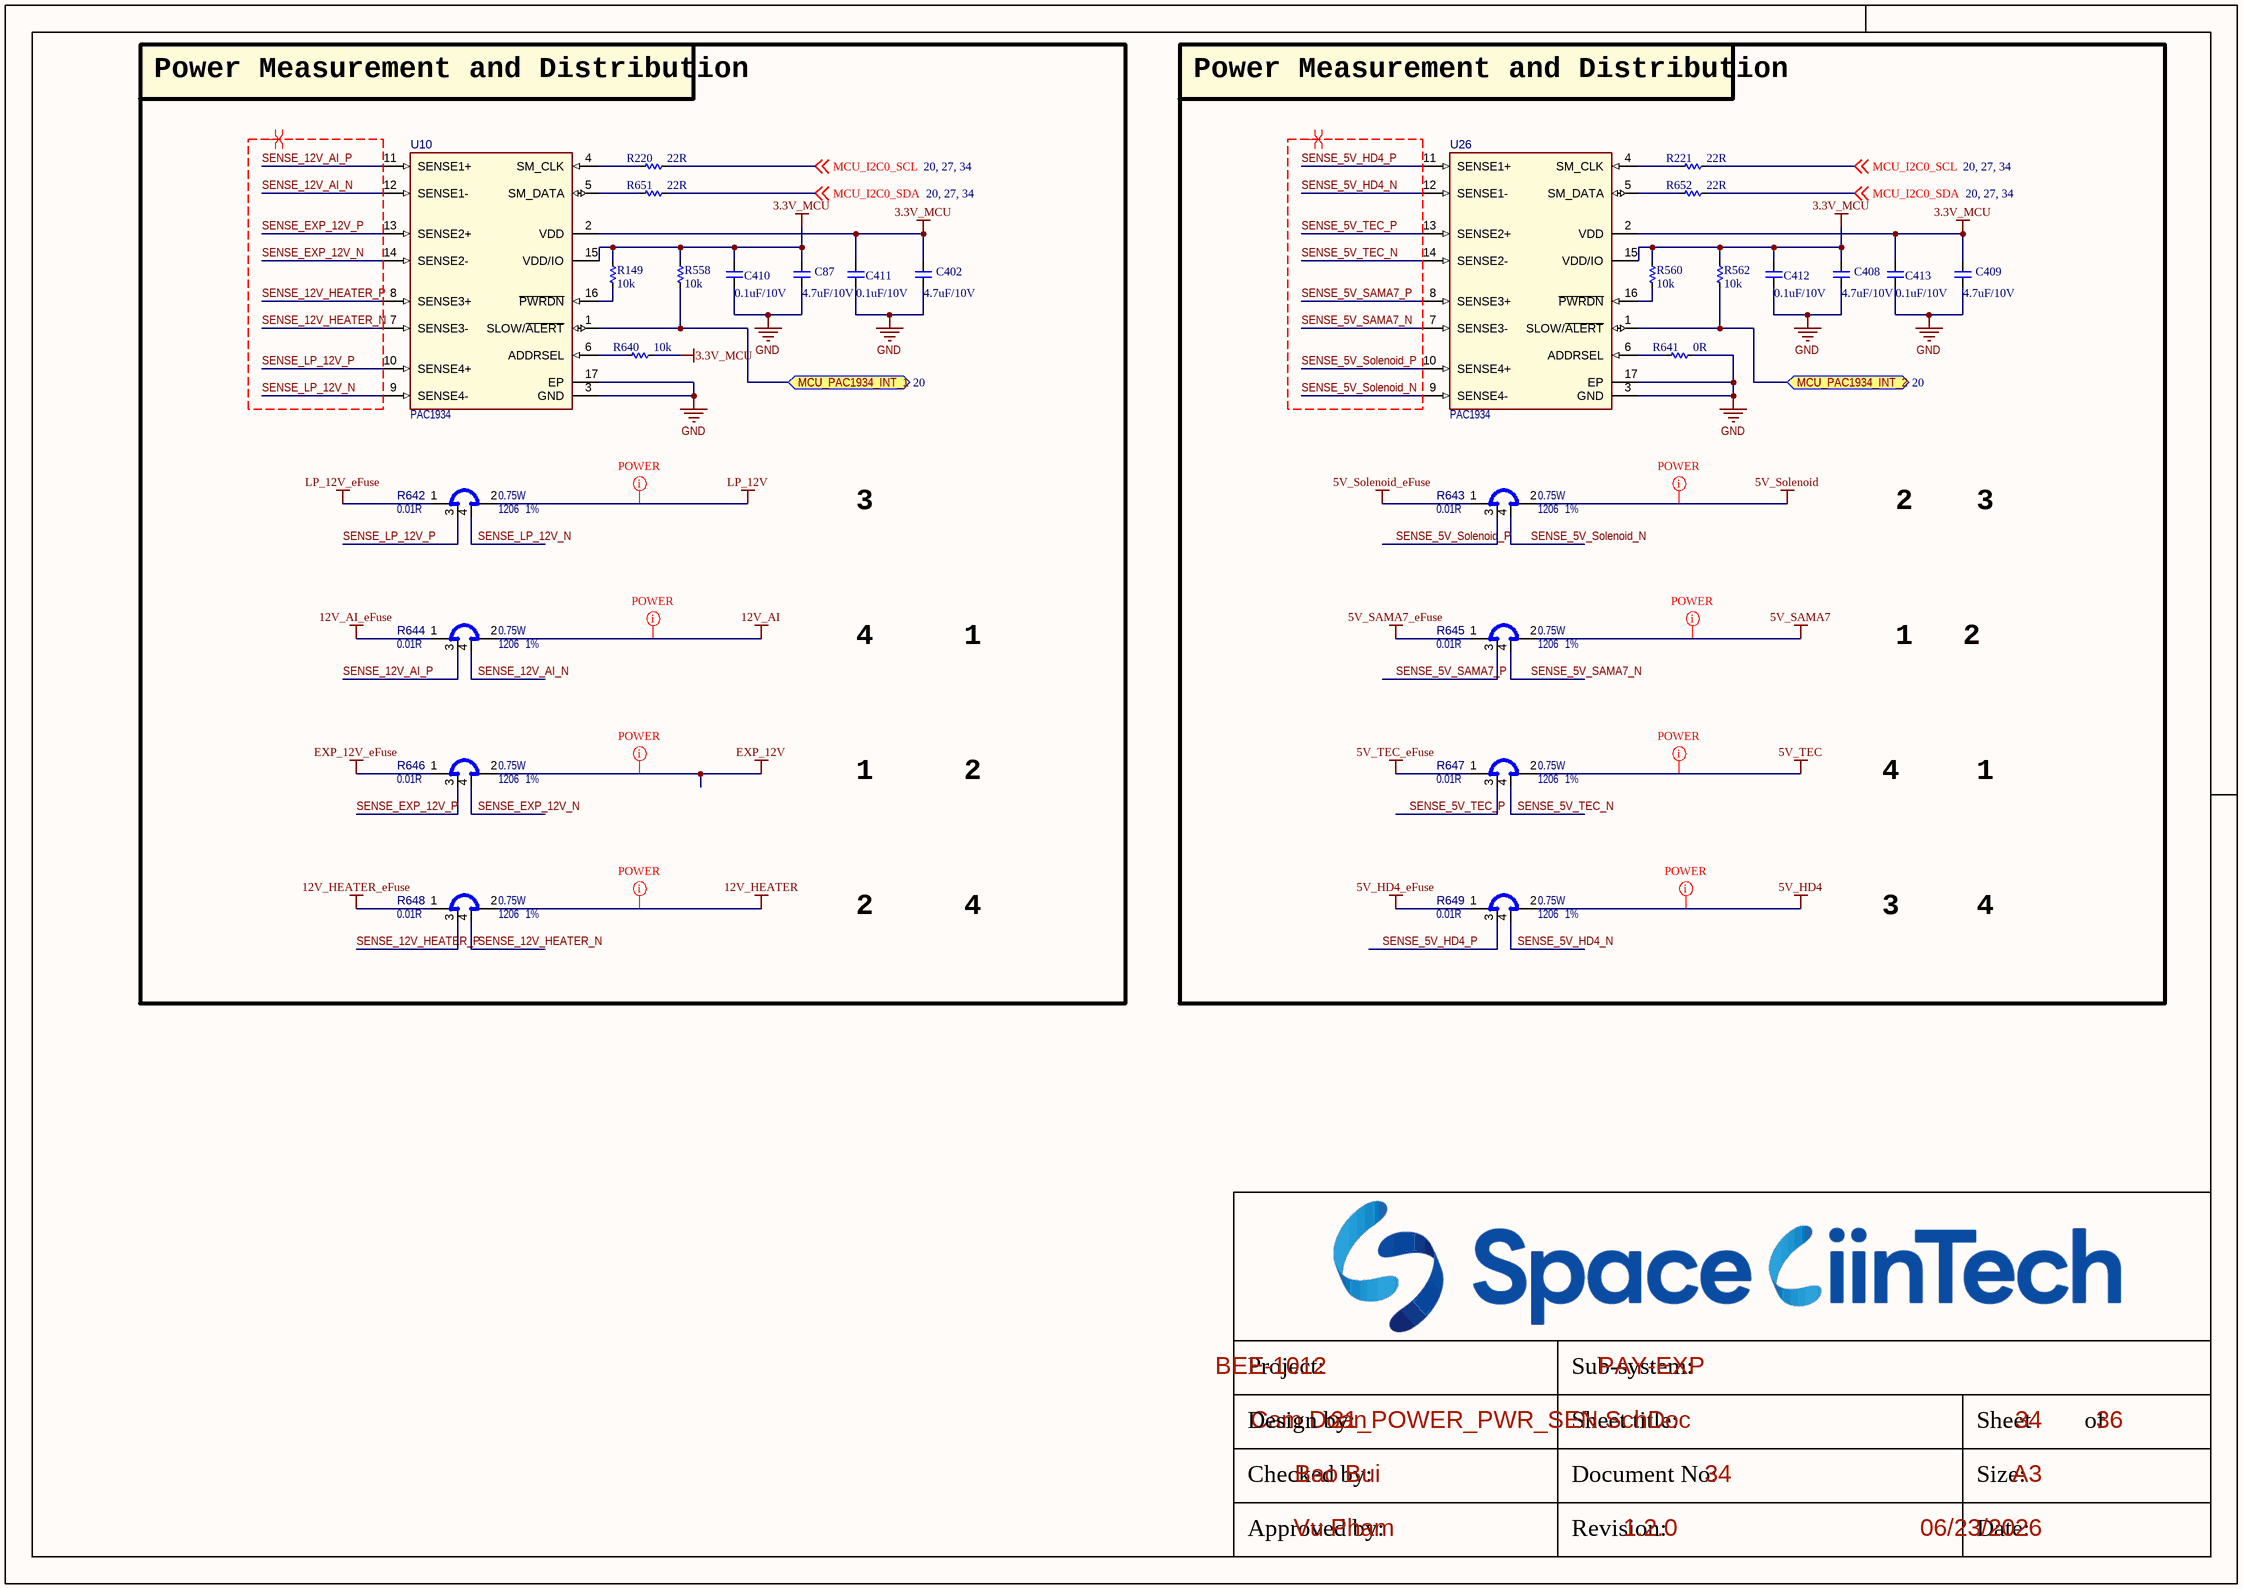
[diagram p34: 21_POWER_PWR_SEN.SchDoc]

### Parts
(Parts that share a designator on the sheet are numbered #1, #2 ... from top to bottom, then left to right.)
C87#2  4.7uF/10V  [CAP_C_1005X60]
C402  4.7uF/10V  [CAP_C_1005X60]
C408  4.7uF/10V  [CAP_C_1005X60]
C409  4.7uF/10V  [CAP_C_1005X60]
C410  0.1uF/10V  [CAP_C_1005X60]
C411  0.1uF/10V  [CAP_C_1005X60]
C412  0.1uF/10V  [CAP_C_1005X60]
C413  0.1uF/10V  [CAP_C_1005X60]
R149#2  10k  [RES_C_1005X40]
R220  22R  [RES_C_1005X40]
R221  22R  [RES_C_1005X40]
R558  10k  [RES_C_1005X40]
R560  10k  [RES_C_1005X40]
R562  10k  [RES_C_1005X40]
R640  10k  [RES_C_1005X40]
R641  0R  [RES_C_1005X40]
R642  value 0.01R  Package: 1206  Tolerance: 1%  Power: 0.75W  [RES_C_1206_SHUNT]  (hidden comment: KRL1632E-M-R010-F-T5)
R643  value 0.01R  Package: 1206  Tolerance: 1%  Power: 0.75W  [RES_C_1206_SHUNT]  (hidden comment: KRL1632E-M-R010-F-T5)
R644  value 0.01R  Package: 1206  Tolerance: 1%  Power: 0.75W  [RES_C_1206_SHUNT]  (hidden comment: KRL1632E-M-R010-F-T5)
R645  value 0.01R  Package: 1206  Tolerance: 1%  Power: 0.75W  [RES_C_1206_SHUNT]  (hidden comment: KRL1632E-M-R010-F-T5)
R646  value 0.01R  Package: 1206  Tolerance: 1%  Power: 0.75W  [RES_C_1206_SHUNT]  (hidden comment: KRL1632E-M-R010-F-T5)
R647  value 0.01R  Package: 1206  Tolerance: 1%  Power: 0.75W  [RES_C_1206_SHUNT]  (hidden comment: KRL1632E-M-R010-F-T5)
R648  value 0.01R  Package: 1206  Tolerance: 1%  Power: 0.75W  [RES_C_1206_SHUNT]  (hidden comment: KRL1632E-M-R010-F-T5)
R649  value 0.01R  Package: 1206  Tolerance: 1%  Power: 0.75W  [RES_C_1206_SHUNT]  (hidden comment: KRL1632E-M-R010-F-T5)
R651  22R  [RES_C_1005X40]
R652  22R  [RES_C_1005X40]
U10#2  value PAC1934  [UQFN-16_4X4_EP2.6X2.6]  (hidden comment: PAC1934 UQFN-16)
U26  value PAC1934  [UQFN-16_4X4_EP2.6X2.6]  (hidden comment: PAC1934 UQFN-16)

### Ports
MCU_PAC1934_INT_1 (bidir, see 20), MCU_PAC1934_INT_2 (bidir, see 20)

### Nets
3.3V_MCU: C87#2.1 C402.1 C408.1 C409.1 C410.1 C411.1 C412.1 C413.1 R149#2.1 R558.1 R560.1 R562.1 R640.2 U10#2.2(VDD) U10#2.15(VDD/IO) U26.2(VDD) U26.15(VDD/IO)
5V_HD4: R649.2
5V_HD4_eFuse: R649.1
5V_SAMA7: R645.2
5V_SAMA7_eFuse: R645.1
5V_Solenoid: R643.2
5V_Solenoid_eFuse: R643.1
5V_TEC: R647.2
5V_TEC_eFuse: R647.1
12V_AI: R644.2
12V_AI_eFuse: R644.1
12V_HEATER: R648.2
12V_HEATER_eFuse: R648.1
EXP_12V: R646.2
EXP_12V_eFuse: R646.1
GND: C87#2.2 C402.2 C408.2 C409.2 C410.2 C411.2 C412.2 C413.2 R641.2 U10#2.3(GND) U10#2.17(EP) U26.3(GND) U26.17(EP)
LP_12V: R642.2
LP_12V_eFuse: R642.1
MCU_I2C0_SCL: R220.2 R221.2 ; off-sheet MCU_I2C0_SCL
MCU_I2C0_SDA: R651.2 R652.2 ; off-sheet MCU_I2C0_SDA
SENSE_5V_HD4_N: R649.4 U26.12(SENSE1-)
SENSE_5V_HD4_P: R649.3 U26.11(SENSE1+)
SENSE_5V_SAMA7_N: R645.4 U26.7(SENSE3-)
SENSE_5V_SAMA7_P: R645.3 U26.8(SENSE3+)
SENSE_5V_Solenoid_N: R643.4 U26.9(SENSE4-)
SENSE_5V_Solenoid_P: R643.3 U26.10(SENSE4+)
SENSE_5V_TEC_N: R647.4 U26.14(SENSE2-)
SENSE_5V_TEC_P: R647.3 U26.13(SENSE2+)
SENSE_12V_AI_N: R644.4 U10#2.12(SENSE1-)
SENSE_12V_AI_P: R644.3 U10#2.11(SENSE1+)
SENSE_12V_HEATER_N: R648.4 U10#2.7(SENSE3-)
SENSE_12V_HEATER_P: R648.3 U10#2.8(SENSE3+)
SENSE_EXP_12V_N: R646.4 U10#2.14(SENSE2-)
SENSE_EXP_12V_P: R646.3 U10#2.13(SENSE2+)
SENSE_LP_12V_N: R642.4 U10#2.9(SENSE4-)
SENSE_LP_12V_P: R642.3 U10#2.10(SENSE4+)
NetR149#2_2: R149#2.2 U10#2.16(~{PWRDN})
NetR220_1: R220.1 U10#2.4(SM_CLK)
NetR221_1: R221.1 U26.4(SM_CLK)
NetR558_2: R558.2 U10#2.1(SLOW/~{ALERT}) ; port MCU_PAC1934_INT_1
NetR560_2: R560.2 U26.16(~{PWRDN})
NetR562_2: R562.2 U26.1(SLOW/~{ALERT}) ; port MCU_PAC1934_INT_2
NetR640_1: R640.1 U10#2.6(ADDRSEL)
NetR641_1: R641.1 U26.6(ADDRSEL)
NetR651_1: R651.1 U10#2.5(SM_DATA)
NetR652_1: R652.1 U26.5(SM_DATA)

### Layout directives
net class POWER: 5V_HD4, 5V_SAMA7, 5V_Solenoid, 5V_TEC, 12V_AI, 12V_HEATER, EXP_12V, LP_12V
differential pair; net class DIFF100; differential pair class DIFF100: SENSE_5V_HD4_N, SENSE_5V_HD4_P, SENSE_5V_SAMA7_N, SENSE_5V_SAMA7_P, SENSE_5V_Solenoid_N, SENSE_5V_Solenoid_P, SENSE_5V_TEC_N, SENSE_5V_TEC_P, SENSE_12V_AI_N, SENSE_12V_AI_P, SENSE_12V_HEATER_N, SENSE_12V_HEATER_P, SENSE_EXP_12V_N, SENSE_EXP_12V_P, SENSE_LP_12V_N, SENSE_LP_12V_P

### Notes on the sheet
- Power Measurement and Distribution
- 3
- 2
- 4
- 1
- Project:
- Sub-system:
- Design by:
- Sheet title:
- Sheet
- of
- Checked by:
- Approved by:
- Revision:
- Document No:
- Size:
- Date:
- A3

### Library data of the parts
C87#2 C402 C408-C413 = _CAP_C_2: CAP
R149#2 R220 R221 R558 R560 R562 R640 R641 R651 R652 = _RES_B_2: RES
R642-R649 = RSMT1316: Shunt; Manufacturer 1: SUSUMU; Description_: RES SHUNT MF 0.01R 1% 0.75W SMD 1206; Dev Tools Status: Design; Temperature Coeffcient: 50ppm/C; Current: 8A; Owner: Ciprian Abramov; Populated: YES; MCHP-ID: RSMT1316; Revision: 1; Symbol: Shunt 4 Pin; Status: MCL Design; ComponentLink1URL: https://chn-vm-apps.microchip.com/mchprepo/parts/Datasheets/n_catalog_partition09_en.pdf; ComponentLink1Description: SVN Datasheet; ComponentLink2URL: C:\ALTIUM_WORK\00001_MCHP-CDB\Datasheets\n_catalog_partition09_en.pdf; ComponentLink2Description: Local Datasheet; ComponentLink3URL: C:\ALTIUM_WORK\00001_MCHP-CDB\Library\LibraryRefs\Shunt 4 Pin.SchLib; ComponentLink3Description: Open Symbol; ComponentLink4URL: C:\ALTIUM_WORK\00001_MCHP-CDB\Library\Footprints\RES_C_1206_SHUNT.PcbLib; ComponentLink4Description: Open Footprint; ComponentLink5Description: Open Footprint 2; ComponentLink6Description: Open Footprint 3; ComponentLink7Description: Open Footprint 4; Operating Temperature: -55C to +155C; Category: Resistor; Type: RES SMD; Composition: MF; Manufacturer Part Number 1: KRL1632E-M-R010-F-T5; Supplier 1: Digi-Key; Supplier Part Number 1: 408-1570-1-ND; Quantity Override: 1
U10#2 U26 = MIC8883: Manufacturer 1: Microchip Technology; Manufacturer Part Number 1: PAC1934T-I/JQ; Description_: MCHP ANALOG POWER CURRENT SENSE MONITOR PAC1934T-I/JQ UQFN-16; Dev Tools Status: Design; Owner: Ciprian Abramov; Populated: YES; MCHP-ID: MIC8883; Symbol: PAC1934 UQFN-16; Type: Power/Current Sensor; Status: MCL Design; Revision: 1; Category: MCHP-Analog; ComponentLink1Description: SVN Datasheet; ComponentLink2Description: Local Datasheet; ComponentLink3URL: C:\ALTIUM_WORK\00001_MCHP-CDB\Library\LibraryRefs\PAC1934 UQFN-16.SchLib; ComponentLink3Description: Open Symbol; ComponentLink4URL: C:\ALTIUM_WORK\00001_MCHP-CDB\Library\Footprints\UQFN-16_4X4_EP2.6X2.6.PcbLib; ComponentLink4Description: Open Footprint; ComponentLink5Description: Open Footprint 2; ComponentLink6Description: Open Footprint 3; ComponentLink7Description: Open Footprint 4; Supplier 1: Digi-Key; Supplier Part Number 1: PAC1934T-I/JQCT-ND; Quantity Override: 1

## Sheet MOUTING.SchDoc
size 420 x 297 mm; SheetNumber: 35; SheetTotal: 36
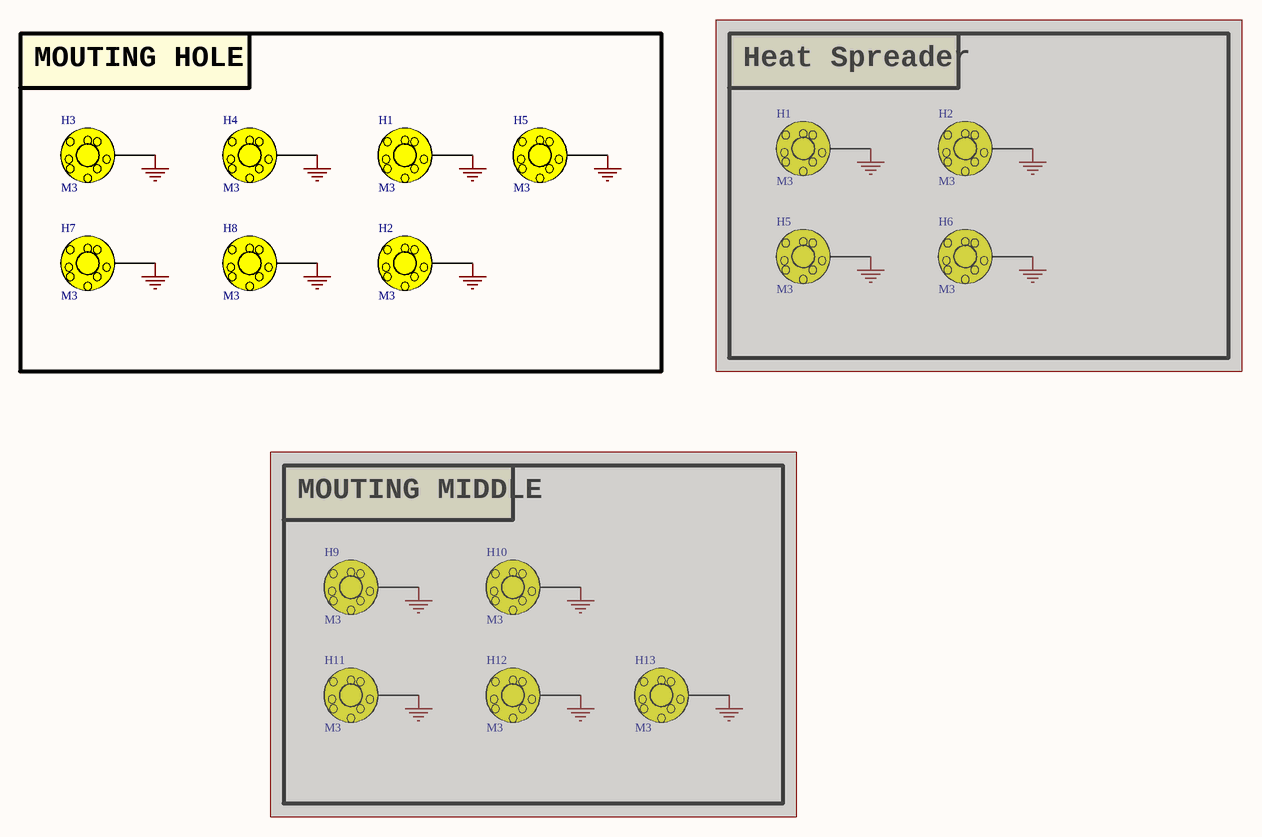
[diagram p35: MOUTING.SchDoc]

### Parts
(Parts that share a designator on the sheet are numbered #1, #2 ... from top to bottom, then left to right.)
H1#1  M3  [HEX-M3_NoVia]  (masked out: inside a compile mask, not in the netlist)
H1#2  M3  [HEX-M3_NoVia]
H2#1  M3  [HEX-M3_NoVia]  (masked out: inside a compile mask, not in the netlist)
H2#2  M3  [HEX-M3_NoVia]
H3  M3  [HEX-M3_NoVia]
H4  M3  [HEX-M3_NoVia]
H5#1  M3  [HEX-M3_NoVia]
H5#2  M3  [HEX-M3_NoVia]  (masked out: inside a compile mask, not in the netlist)
H6  M3  [HEX-M3_NoVia]  (masked out: inside a compile mask, not in the netlist)
H7  M3  [HEX-M3_NoVia]
H8  M3  [HEX-M3_NoVia]
H9  M3  [HEX-M3_NoVia]  (masked out: inside a compile mask, not in the netlist)
H10  M3  [HEX-M3_NoVia]  (masked out: inside a compile mask, not in the netlist)
H11  M3  [HEX-M3_NoVia]  (masked out: inside a compile mask, not in the netlist)
H12  M3  [HEX-M3_NoVia]  (masked out: inside a compile mask, not in the netlist)
H13  M3  [HEX-M3_NoVia]  (masked out: inside a compile mask, not in the netlist)

### Blocks framed on the sheet
MOUTING HOLE: H1#2 H2#2 H3 H4 H5#1 H7 H8
Heat Spreader: H1#1 H2#1 H5#2 H6
MOUTING MIDDLE: H9-H13

### Nets
GND: H1#2.1 H2#2.1 H3.1 H4.1 H5#1.1 H7.1 H8.1

### Notes on the sheet
- Project:
- Sub-system:
- Design by:
- Sheet title:
- Sheet
- of
- Checked by:
- Approved by:
- Revision:
- Document No:
- Size:
- Date:
- A3

### Library data of the parts
H1#1 H1#2 H2#1 H2#2 H3 H4 H5#1 H5#2 H6-H13 = HEX-M3

## Sheet ANA_SWITCH.SchDoc
size 420 x 297 mm; SheetNumber: 35; SheetTotal: 35
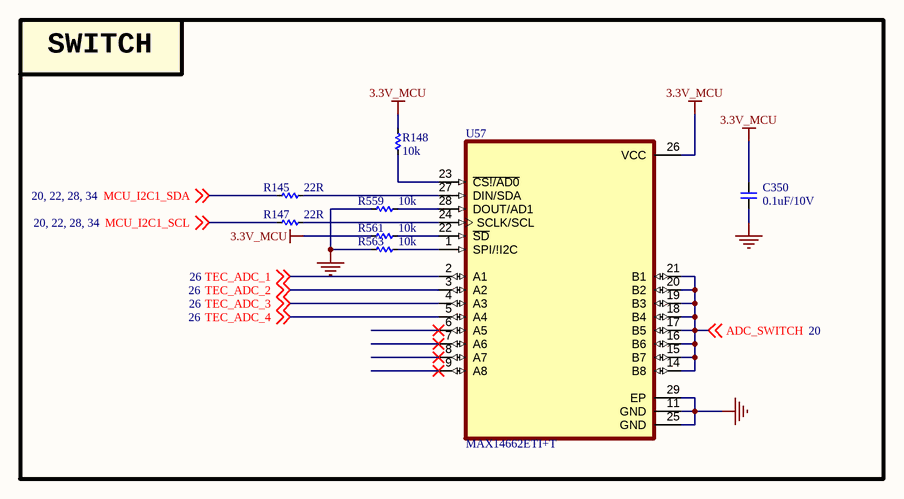
[diagram p36: ANA_SWITCH.SchDoc]

### Parts
(Parts that share a designator on the sheet are numbered #1, #2 ... from top to bottom, then left to right.)
C350  0.1uF/10V  [CAP_C_1005X60]
R145#2  22R  [RES_C_1005X40]
R147#2  22R  [RES_C_1005X40]
R148#2  10k  [RES_C_1005X40]
R559  10k  [RES_C_1005X40]
R561  10k  [RES_C_1005X40]
R563  10k  [RES_C_1005X40]
U57  MAX14662ETI+T  [QFN40P400X400X80-29N]

### Blocks framed on the sheet
SWITCH: C350 R145#2 R147#2 R148#2 R559 R561 R563 U57

### Nets
3.3V_MCU: C350.2 R148#2.1 R561.1 U57.26(VCC)
GND: C350.1 R559.1 R563.1 U57.11(GND) U57.25(GND) U57.29(EP)
ADC_SWITCH: U57.14(B8) U57.15(B7) U57.16(B6) U57.17(B5) U57.18(B4) U57.19(B3) U57.20(B2) U57.21(B1) ; off-sheet ADC_SWITCH
MCU_I2C1_SCL: R147#2.1 ; off-sheet MCU_I2C1_SCL
MCU_I2C1_SDA: R145#2.1 ; off-sheet MCU_I2C1_SDA
TEC_ADC_1: U57.2(A1) ; off-sheet TEC_ADC_1
TEC_ADC_2: U57.3(A2) ; off-sheet TEC_ADC_2
TEC_ADC_3: U57.4(A3) ; off-sheet TEC_ADC_3
TEC_ADC_4: U57.5(A4) ; off-sheet TEC_ADC_4
NetR145#2_2: R145#2.2 U57.27(DIN/SDA)
NetR147#2_2: R147#2.2 U57.24(SCLK/SCL)
NetR148#2_2: R148#2.2 U57.23(~{CS!/AD0})
NetR559_2: R559.2 U57.28(DOUT/AD1)
NetR561_2: R561.2 U57.22(~{SD})
NetR563_2: R563.2 U57.1(SPI/!I2C)

Not connected (* = marked no-connect by the designer): U57 6(A5)* 7(A6)* 8(A7)* 9(A8)*

### Notes on the sheet
- Project:
- Sub-system:
- Design by:
- Sheet title:
- Sheet
- of
- Checked by:
- Approved by:
- Revision:
- Document No:
- Size:
- Date:
- A3

### Library data of the parts
C350 = _CAP_C_2: CAP
R145#2 R147#2 R148#2 R559 R561 R563 = _RES_B_2: RES
U57 = IC_SW_MAX14662ETI+T: 8 Circuit IC Switch 1:1 1Ohm 28-TQFN _4x4_; MF: Maxim Integrated; Package: TQFN-28 Maxim; Value: *; Price: None; MP: MAX14662ETI+T; SnapEDA_Link: https://www.snapeda.com/parts/MAX14662ETI%2BT/Maxim%20Integrated/view-part/546683/?ref=snap; Availability: Unavailable

## Nets that join several sheets
3.3_VBAT: 08_SAMA7G54-MPU (R332.1), 13_MRAM_RTC_WDT (5 pins)
3.3V_MCU: 05_CONNECTOR_OUT (8 pins), 06_POWER_1 (5 pins), 07_CAN (C184.1 C185.1 U41.3), 11_MCU (23 pins), 12_CONSOLE (C141.2 J19.1 R246.2 R247.2), 13_MRAM_RTC_WDT (28 pins), 14_NTC_TEMPSENSOR (18 pins), 16_TEC (12 pins), 17_FLOW_Sensor (32 pins), 17_I2C_Sensor_OnBoard (15 pins), 18_HD4_PUMP (C117.2 R197.1 R198.1 U17.1), 19_SOLENOID_HB_1 (15 pins), 21_POWER_PWR_SEN (17 pins), ANA_SWITCH (C350.2 R148#2.1 R561.1 U57.26)
3.3V_SAMA7: 05_CONNECTOR_OUT (R273.1 R274.1 R276.1), 06_POWER_2 (5 pins), 07_CAN (6 pins), 08_SOM_USB_CARD (14 pins), 10_USB (9 pins), 12_CONSOLE (27 pins), 13_MRAM_RTC_WDT (R454.2)
5V_HD4: 06_POWER_4 (DS7.2), 18_HD4_PUMP (10 pins), 21_POWER_PWR_SEN (R649.2)
5V_HD4_eFuse: 06_POWER_4 (7 pins), 21_POWER_PWR_SEN (R649.1)
5V_MCU: 06_POWER_1 (7 pins), 06_POWER_2 (6 pins), 06_POWER_3 (R411.1 R416.1), 06_POWER_4 (R424.1 R432.1), 06_POWER_5 (R128.1 R210.1), 20_AI_Board (R602.1)
5V_PERI: 06_POWER_3 (10 pins), 06_POWER_4 (10 pins)
5V_SAMA7: 05_CONNECTOR_IN (JP19.1), 05_CONNECTOR_OUT (J24.11), 06_POWER_2 (C147.1 DS3.2 VR2.3), 08_SAMA7G54-PMIC (13 pins), 08_SAMA7G54-PIO (R533.1), 10_USB (JP8.2), 21_POWER_PWR_SEN (R645.2)
5V_SAMA7_eFuse: 06_POWER_2 (7 pins), 21_POWER_PWR_SEN (R645.1)
5V_Solenoid: 06_POWER_4 (DS8.2), 19_SOLENOID_HB_1 (60 pins), 19_SOLENOID_OF (8 pins), 21_POWER_PWR_SEN (R643.2)
5V_Solenoid_eFuse: 06_POWER_4 (7 pins), 21_POWER_PWR_SEN (R643.1)
5V_TEC: 06_POWER_3 (DS6.2), 16_TEC (20 pins), 21_POWER_PWR_SEN (R647.2)
5V_TEC_eFuse: 06_POWER_3 (7 pins), 21_POWER_PWR_SEN (R647.1)
12V_AI: 20_AI_Board (C395.2 C396.2 U73.7), 21_POWER_PWR_SEN (R644.2)
12V_AI_eFuse: 20_AI_Board (7 pins), 21_POWER_PWR_SEN (R644.1)
12V_HEATER: 06_POWER_5 (DS10.2), 15_HEATER (17 pins), 21_POWER_PWR_SEN (R648.2)
12V_HEATER_eFuse: 06_POWER_5 (7 pins), 21_POWER_PWR_SEN (R648.1)
EXP_12V: 06_POWER_1 (C8#2.2 C9.2 U2.7), 06_POWER_3 (C159.2 U35.7), 06_POWER_5 (10 pins), 20_AI_Board (5 pins), 21_POWER_PWR_SEN (R646.2)
EXP_12V_eFuse: 06_POWER_1 (7 pins), 21_POWER_PWR_SEN (R646.1)
GND: 05_CONNECTOR_IN (19 pins), 05_CONNECTOR_OUT (13 pins), 06_POWER_1 (24 pins), 06_POWER_2 (17 pins), 06_POWER_3 (21 pins), 06_POWER_4 (24 pins), 06_POWER_5 (24 pins), 07_CAN (13 pins), 08_SAMA7G54-MPU (115 pins), 08_SAMA7G54-PMIC (29 pins), 08_SAMA7G54-PIO (10 pins), 08_SAMA7G54-DDR3 (84 pins), 08_SOM_USB_CARD (13 pins), 09_eMMC (30 pins), 10_USB (43 pins), 11_MCU (49 pins), 12_CONSOLE (39 pins), 13_MRAM_RTC_WDT (20 pins), 14_NTC_TEMPSENSOR (38 pins), 15_HEATER (21 pins), 16_TEC (54 pins), 17_FLOW_Sensor (30 pins), 17_I2C_Sensor_OnBoard (10 pins), 18_HD4_PUMP (14 pins), 18_HD4_PUMP_2 (9 pins), 19_SOLENOID_HB_1 (50 pins), 19_SOLENOID_OF (10 pins), 20_AI_Board (25 pins), 21_POWER_PWR_SEN (13 pins), MOUTING (7 pins), ANA_SWITCH (6 pins)
IF_12V: 05_CONNECTOR_IN (J1.1 J1.2 J1.3 TP3.1), 06_POWER_1 (5 pins)
LP_12V: 05_CONNECTOR_OUT (J21.1 J22.1 J23.1), 06_POWER_5 (DS9.2), 18_HD4_PUMP_2 (5 pins), 21_POWER_PWR_SEN (R642.2)
LP_12V_eFuse: 06_POWER_5 (7 pins), 21_POWER_PWR_SEN (R642.1)
VDD_3V3: 05_CONNECTOR_IN (9 pins), 05_CONNECTOR_OUT (R352.1 R359.1), 08_SAMA7G54-MPU (7 pins), 08_SAMA7G54-PMIC (18 pins), 08_SAMA7G54-PIO (6 pins), 08_SOM_USB_CARD (C191.2 JP7.2 R455.2 U42.8), 09_eMMC (38 pins)
VDD_3V3_MPU: 08_SAMA7G54-MPU (36 pins), 08_SAMA7G54-PMIC (5 pins)
VDDCORE: 08_SAMA7G54-MPU (30 pins), 08_SAMA7G54-PMIC (R344.2 TP8.1)
VDDCPU: 08_SAMA7G54-MPU (11 pins), 08_SAMA7G54-PMIC (R349.2 TP10.1)
VDDIODDR: 08_SAMA7G54-PMIC (R354.2 TP16.1), 08_SAMA7G54-DDR3 (73 pins)
ADC_SWITCH: 11_MCU (R79.1), ANA_SWITCH (8 pins)
ADC_TEMP1: 11_MCU (R143.2), 14_NTC_TEMPSENSOR (C98.2 R174.2)
ADC_TEMP2: 11_MCU (R150.2), 14_NTC_TEMPSENSOR (C94.2 R168.2)
ADC_TEMP3: 11_MCU (R108.2), 14_NTC_TEMPSENSOR (C106.2 R180.2)
ADC_TEMP4: 11_MCU (R75.1), 14_NTC_TEMPSENSOR (C110.2 R186.2)
ADC_TEMP5: 11_MCU (R89.2), 14_NTC_TEMPSENSOR (C101.2 R175.2)
ADC_TEMP6: 11_MCU (R84.2), 14_NTC_TEMPSENSOR (C95.2 R169.2)
ADC_TEMP7: 11_MCU (R278.2), 14_NTC_TEMPSENSOR (C107.2 R181.2)
ADC_TEMP8: 11_MCU (R106.2), 14_NTC_TEMPSENSOR (C113.2 R187.2)
CAN_H: 07_CAN (5 pins), 20_AI_Board (J20.5)
CAN_L: 07_CAN (5 pins), 20_AI_Board (J20.4)
CANRX1: 07_CAN (U41.4), 11_MCU (R82.2)
CANTX1: 07_CAN (U41.1), 11_MCU (R87.2)
CPU_IR_LED_PWM: 08_SAMA7G54-PIO (R653.1), 18_HD4_PUMP_2 (R655.2 R656.1)
CPU_MCU_SPI_CS: 08_SAMA7G54-PIO (R309.1), 11_MCU (R286.2)
CPU_WD_nRESET: 08_SAMA7G54-MPU (R505.1 U29.J7), 08_SAMA7G54-PMIC (R340.1 U51.2), 08_SAMA7G54-PIO (C300.2 R535.1)
HEATER_PWM_1: 11_MCU (R52.2), 15_HEATER (R152.1)
HEATER_PWM_2: 11_MCU (R11.2), 15_HEATER (R159.1)
HEATER_PWM_3: 11_MCU (R13.2), 15_HEATER (R164.1)
HEATER_PWM_4: 11_MCU (R50.2), 15_HEATER (R166.1)
HEATER_PWM_5: 11_MCU (R74.2), 15_HEATER (R153.1)
HEATER_PWM_6: 11_MCU (R101.2), 15_HEATER (R160.1)
HEATER_PWM_7: 11_MCU (R70.2), 15_HEATER (R154.1)
HEATER_PWM_8: 11_MCU (R71.2), 15_HEATER (R158.1)
IF_MCU_SHUTDOWN: 05_CONNECTOR_IN (J1.7), 11_MCU (R312.1)
IF_USB_N: 05_CONNECTOR_IN (J2.8 R625.1), 12_CONSOLE (U32.30)
IF_USB_P: 05_CONNECTOR_IN (J2.7 R626.1), 12_CONSOLE (U32.31)
LASER_ADC_1: 05_CONNECTOR_OUT (J23.10), 11_MCU (R73.1)
LASER_ADC_2: 05_CONNECTOR_OUT (J23.11), 11_MCU (R77.1)
LASER_DAC_LATCH: 05_CONNECTOR_OUT (J23.7 R292.2), 11_MCU (R91.2)
LASER_SPI_nCS1: 05_CONNECTOR_OUT (J23.6 R291.2), 11_MCU (R59.2)
LASER_SW_EXT_CS: 05_CONNECTOR_OUT (J23.9 R294.2), 11_MCU (R37.2)
LASER_SW_INT_CS: 05_CONNECTOR_OUT (J23.8 R293.2), 11_MCU (R72.2)
LPM: 08_SAMA7G54-MPU (U29.R10), 08_SAMA7G54-PMIC (Q27.1 R331.1)
LSM6DSOX_INT: 11_MCU (R99.2), 17_I2C_Sensor_OnBoard (R658.2 U49.9)
MCP16502_HPM: 08_SAMA7G54-PMIC (R333.1), 08_SAMA7G54-PIO (R386.1 R533.2 R536.1)
MCU_CONSOLE_RX: 11_MCU (R49.1), 12_CONSOLE (R247.1 R283.2)
MCU_CONSOLE_TX: 11_MCU (R51.1), 12_CONSOLE (R246.1 R279.2)
MCU_FRAM_nCS: 11_MCU (R41.2), 13_MRAM_RTC_WDT (R450.1 U56.1)
MCU_HD4_I2C2_SCL: 11_MCU (R55.1), 18_HD4_PUMP (R22.1 R197.2)
MCU_HD4_I2C2_SDA: 11_MCU (R53.1), 18_HD4_PUMP (R40.1 R198.2)
MCU_HD4_I2C_EN: 11_MCU (R93.2), 18_HD4_PUMP (R203.1 U17.5)
MCU_I2C0_SCL: 11_MCU (R20.2), 17_FLOW_Sensor (6 pins), 21_POWER_PWR_SEN (R220.2 R221.2)
MCU_I2C0_SDA: 11_MCU (R17.2), 17_FLOW_Sensor (6 pins), 21_POWER_PWR_SEN (R651.2 R652.2)
MCU_I2C1_SCL: 11_MCU (R86.1), 13_MRAM_RTC_WDT (R399.1 U31.4), 17_I2C_Sensor_OnBoard (R503.1 R628.1), ANA_SWITCH (R147#2.1)
MCU_I2C1_SDA: 11_MCU (R81.1), 13_MRAM_RTC_WDT (R400.1 U31.5), 17_I2C_Sensor_OnBoard (R502.2 R629.1), ANA_SWITCH (R145#2.1)
MCU_LASER_QSPI_MISO: 05_CONNECTOR_OUT (J23.4), 11_MCU (R524.2)
MCU_LASER_QSPI_MOSI: 05_CONNECTOR_OUT (J23.3), 11_MCU (R458.2)
MCU_LASER_QSPI_SCK: 05_CONNECTOR_OUT (J23.5), 11_MCU (R632.2)
MCU_MRAM_QSPI_CLK: 11_MCU (R34.2 R632.1), 13_MRAM_RTC_WDT (R635.1)
MCU_MRAM_QSPI_IO0: 11_MCU (R32.2 R458.1), 13_MRAM_RTC_WDT (R636.1)
MCU_MRAM_QSPI_IO1: 11_MCU (R30.2 R524.1), 13_MRAM_RTC_WDT (R623.2)
MCU_PRAM_SPI1_nCS: 11_MCU (R105.2), 13_MRAM_RTC_WDT (R530.1 U71.2)
MCU_PRAM_SW_SEL: 11_MCU (R457.2), 13_MRAM_RTC_WDT (R526.1 U71.1)
MCU_RAM_QSPI_nCS: 11_MCU (R28.2), 13_MRAM_RTC_WDT (R396.1 U30.1)
MCU_RTC_CLKOUT: 11_MCU (R68.2), 13_MRAM_RTC_WDT (R397.1 U31.3)
MCU_RTC_INT: 11_MCU (R69.2), 13_MRAM_RTC_WDT (R398.1 U31.7)
MCU_SENSOR1_nIRQ: 11_MCU (R126.1), 17_FLOW_Sensor (J13.1)
MCU_SENSOR2_nIRQ: 11_MCU (R127.1), 17_FLOW_Sensor (J14.1)
MCU_SENSOR3_nIRQ: 11_MCU (R57.2), 17_FLOW_Sensor (J27.1)
MCU_SENSOR4_nIRQ: 11_MCU (R277.2), 17_FLOW_Sensor (J28.1)
MCU_SOM_GPIO_A: 08_SAMA7G54-PIO (R392.1), 11_MCU (R25.1)
MCU_SOM_GPIO_B: 08_SAMA7G54-PIO (R388.1), 11_MCU (R27.1)
MCU_SPI0_CMD_SOLE_A: 11_MCU (R622.2), 19_SOLENOID_HB_1 (R476.1)
MCU_SPI0_CMD_SOLE_B: 11_MCU (R620.1), 19_SOLENOID_HB_1 (R498.1)
MCU_SPI0_CMD_SOLE_C: 11_MCU (R617.1), 19_SOLENOID_HB_1 (R572.1)
MCU_SPI0_CMD_SOLE_D: 11_MCU (R616.1), 19_SOLENOID_HB_1 (R477.1)
MCU_SPI0_CMD_SOLE_E: 11_MCU (R615.2), 19_SOLENOID_HB_1 (R500.1)
MCU_SPI0_MISO: 05_CONNECTOR_OUT (R557.1), 11_MCU (R42.1 R141.2)
MCU_SPI0_MOSI: 05_CONNECTOR_OUT (R555.1), 11_MCU (R43.1)
MCU_SPI0_nCS_SOLE_A: 11_MCU (R621.1), 19_SOLENOID_HB_1 (R369.1)
MCU_SPI0_nCS_SOLE_B: 11_MCU (R619.1), 19_SOLENOID_HB_1 (R488.1)
MCU_SPI0_nCS_SOLE_C: 11_MCU (R613.1), 19_SOLENOID_HB_1 (R568.1)
MCU_SPI0_nCS_SOLE_D: 11_MCU (R618.1), 19_SOLENOID_HB_1 (R372.1)
MCU_SPI0_nCS_SOLE_E: 11_MCU (R614.2), 19_SOLENOID_HB_1 (R493.1)
MCU_SPI0_SCK: 05_CONNECTOR_OUT (R314.1), 11_MCU (R45.1)
MCU_SPI1_MISO: 08_SAMA7G54-PIO (R456.1), 11_MCU (R103.2 R285.2), 13_MRAM_RTC_WDT (U71.14)
MCU_SPI1_MOSI: 08_SAMA7G54-PIO (R395.1), 11_MCU (R104.2), 13_MRAM_RTC_WDT (U71.11)
MCU_SPI1_SCK: 08_SAMA7G54-PIO (R308.1), 11_MCU (R102.2), 13_MRAM_RTC_WDT (U71.5)
MCU_UART0_RX_SOM_TX: 08_SAMA7G54-PIO (R528.1), 11_MCU (R24.2)
MCU_UART0_TX_SOM_RX: 08_SAMA7G54-PIO (R529.1), 11_MCU (R26.2)
MCU_USART_RXD2: 11_MCU (R131.1), 13_MRAM_RTC_WDT (U56.2), 16_TEC (U6.18 U7.18 U8.18 U9.18), 19_SOLENOID_HB_1 (10 pins)
MCU_USART_SCK2: 11_MCU (R39.1), 13_MRAM_RTC_WDT (U56.6), 16_TEC (U6.16 U7.16 U8.16 U9.16), 19_SOLENOID_HB_1 (5 pins)
MCU_USART_TXD2: 11_MCU (R133.1), 13_MRAM_RTC_WDT (U56.5), 16_TEC (U6.17 U7.17 U8.17 U9.17), 19_SOLENOID_HB_1 (5 pins)
MCU_WD_DONE: 11_MCU (R65.1), 13_MRAM_RTC_WDT (U34.4)
MCU_WD_nRESET: 11_MCU (R303.2), 13_MRAM_RTC_WDT (R408.1)
MCU_WD_WAKE: 11_MCU (R67.1), 13_MRAM_RTC_WDT (U34.5)
MIPI_CK_N: 05_CONNECTOR_OUT (R575.1), 08_SAMA7G54-MPU (U29.N20)
MIPI_CK_P: 05_CONNECTOR_OUT (R576.1), 08_SAMA7G54-MPU (U29.N21)
MIPI_D0_N: 05_CONNECTOR_OUT (R391.1), 08_SAMA7G54-MPU (U29.R18)
MIPI_D0_P: 05_CONNECTOR_OUT (R486.1), 08_SAMA7G54-MPU (U29.P18)
MIPI_D1_N: 05_CONNECTOR_OUT (R516.1), 08_SAMA7G54-MPU (U29.R20)
MIPI_D1_P: 05_CONNECTOR_OUT (R574.1), 08_SAMA7G54-MPU (U29.R21)
NetC355_1: 08_SAMA7G54-MPU (C355.1 JP15.1), 08_SAMA7G54-PMIC (U51.24), 11_MCU (R107.2)
NetQ27_3: 08_SAMA7G54-MPU (Y2.1), 08_SAMA7G54-PMIC (Q27.3 R350.2)
NetR337_2: 08_SAMA7G54-PMIC (R337.2 U52.1), 08_SAMA7G54-PIO (R588.1)
NetR342_1: 08_SAMA7G54-PMIC (R342.1 U51.1), 08_SAMA7G54-PIO (U29.D19)
NetR558_2: 11_MCU (R631.2), 21_POWER_PWR_SEN (R558.2 U10#2.1)
NetR562_2: 11_MCU (R650.2), 21_POWER_PWR_SEN (R562.2 U26.1)
OBC_CAN_H: 05_CONNECTOR_IN (J1.9), 07_CAN (R440.1)
OBC_CAN_L: 05_CONNECTOR_IN (J1.8), 07_CAN (R444.1)
PHOTO_ADC_CONV: 05_CONNECTOR_OUT (J21.8 R271.2), 11_MCU (R36.2)
PHOTO_ADC_CS: 05_CONNECTOR_OUT (J21.7 R270.2), 11_MCU (R12.1)
PHOTO_ADC_EOC: 05_CONNECTOR_OUT (J21.9 R272.2), 11_MCU (R151.2)
PHOTO_SPI0_nCS2: 05_CONNECTOR_OUT (J21.6 R269.2), 11_MCU (R31.1)
POW_ONOFF_AI: 11_MCU (R624.2), 20_AI_Board (R602.2 R610.1 U48.1)
POW_ONOFF_BUCK_PERI: 06_POWER_3 (R411.2 R414.1 U35.5), 11_MCU (R282.1)
POW_ONOFF_HD4: 06_POWER_4 (R424.2 R429.1 U37.1), 11_MCU (R18.1)
POW_ONOFF_HEATER: 06_POWER_5 (R210.2 R223.1 U44.1), 11_MCU (R280.2)
POW_ONOFF_LP: 06_POWER_5 (R128.2 R139.1 U43.1), 11_MCU (R23.1)
POW_ONOFF_Solenoid: 06_POWER_4 (R432.2 R437.1 U38.1), 11_MCU (R16.1)
POW_ONOFF_SOM: 06_POWER_2 (R248.2 R252.1 U24.1), 11_MCU (R21.1)
POW_ONOFF_TEC: 06_POWER_3 (R416.2 R421.1 U36.1), 11_MCU (R19.1)
RS422_DE: 05_CONNECTOR_IN (R305.2 U54.3), 08_SAMA7G54-PIO (R600.1)
RS422_~{RE}: 05_CONNECTOR_IN (R304.2 U54.2), 08_SAMA7G54-PIO (R531.1)
SAM7_FLEX1_I2C_SCL: 08_SAMA7G54-PMIC (R329.2 U51.6 U52.4), 08_SAMA7G54-PIO (R515.1)
SAM7_FLEX1_I2C_SDA: 08_SAMA7G54-PMIC (R330.2 U51.5 U52.5), 08_SAMA7G54-PIO (R514.1)
SD2_CLK: 08_SAMA7G54-PIO (R485.1), 08_SOM_USB_CARD (J17.P5 R231.1 U21.3)
SD2_CMD: 08_SAMA7G54-PIO (R459.1), 08_SOM_USB_CARD (J17.P3 R232.1 U22.6)
SD2_DATA0: 08_SAMA7G54-PIO (R487.1), 08_SOM_USB_CARD (J17.P7 R227.1 U21.6)
SD2_DATA1: 08_SAMA7G54-PIO (R510.1), 08_SOM_USB_CARD (J17.P8 R228.1 U21.1)
SD2_DATA2: 08_SAMA7G54-PIO (R511.1), 08_SOM_USB_CARD (J17.P1 R229.1 U22.3)
SD2_DATA3: 08_SAMA7G54-PIO (R512.1), 08_SOM_USB_CARD (J17.P2 R230.1 U22.4)
SD2_nCD: 08_SAMA7G54-PIO (R513.1), 08_SOM_USB_CARD (J17.P9 R226.1)
SENSOR1_EN: 11_MCU (R76.2), 17_FLOW_Sensor (R213.1 U18.5)
SENSOR2_EN: 11_MCU (R78.2), 17_FLOW_Sensor (R217.1 U19.5)
SENSOR3_EN: 11_MCU (R54.2), 17_FLOW_Sensor (R462.1 U45.5)
SENSOR4_EN: 11_MCU (R56.2), 17_FLOW_Sensor (R465.1 U46.5)
SENSOR5_EN: 11_MCU (R80.2), 17_FLOW_Sensor (R225.1 U20.5)
SHDN: 08_SAMA7G54-MPU (U29.R9), 08_SAMA7G54-PMIC (R335.1)
SOLENOID_CTR_1: 11_MCU (R44.2), 19_SOLENOID_OF (R466.2)
SOLENOID_CTR_2: 11_MCU (R46.2), 19_SOLENOID_OF (R467.2)
SOLENOID_CTR_3: 11_MCU (R47.2), 19_SOLENOID_OF (R468.2)
SOLENOID_CTR_4: 11_MCU (R48.2), 19_SOLENOID_OF (R469.2)
SOM_AI_RX: 08_SAMA7G54-PIO (R598.1), 20_AI_Board (R565.1)
SOM_AI_TX: 08_SAMA7G54-PIO (R597.1), 20_AI_Board (R566.1)
SOM_CAM_I2C_SCL: 05_CONNECTOR_OUT (R352.2 R577.1), 08_SAMA7G54-PIO (R520.1)
SOM_CAM_I2C_SDA: 05_CONNECTOR_OUT (R359.2 R627.1), 08_SAMA7G54-PIO (R522.1)
SOM_CANRX0: 07_CAN (U39.4), 08_SAMA7G54-PIO (R519.1)
SOM_CANRX1: 07_CAN (U40.4), 08_SAMA7G54-PIO (R523.1)
SOM_CANTX0: 07_CAN (U39.1), 08_SAMA7G54-PIO (R517.1)
SOM_CANTX1: 07_CAN (U40.1), 08_SAMA7G54-PIO (R521.1)
SOM_CONSOLE_RX: 08_SAMA7G54-PIO (R527.1), 12_CONSOLE (R245.1 R268.2 R316.2)
SOM_CONSOLE_TX: 08_SAMA7G54-PIO (R525.1), 12_CONSOLE (R244.1 R267.2 R295.2)
SOM_EMMC_nRST: 08_SAMA7G54-PIO (R360.1), 09_eMMC (R243.1 U23.M5)
SOM_EXT_LASER_ADC: 05_CONNECTOR_OUT (J22.11), 08_SAMA7G54-PIO (R275.1)
SOM_EXT_LASER_ADC_nCS: 05_CONNECTOR_OUT (J22.6 R273.2), 08_SAMA7G54-PIO (R370.1)
SOM_EXT_LASER_ADC_nCS1: 05_CONNECTOR_OUT (J22.9 R276.2), 08_SAMA7G54-PIO (R583.1)
SOM_EXT_LASER_LATCH: 05_CONNECTOR_OUT (J22.7 R274.2), 08_SAMA7G54-PIO (R387.1)
SOM_EXT_LASER_SPI_MISO: 05_CONNECTOR_OUT (R556.1), 08_SAMA7G54-PIO (R364.1)
SOM_EXT_LASER_SPI_MOSI: 05_CONNECTOR_OUT (R554.1), 08_SAMA7G54-PIO (R362.1)
SOM_EXT_LASER_SPI_SCK: 05_CONNECTOR_OUT (R630.1), 08_SAMA7G54-PIO (R367.1)
SOM_MRAM_QSPI_CLK: 08_SAMA7G54-PIO (R385.1), 08_SOM_USB_CARD (U42.6)
SOM_MRAM_QSPI_IO0: 08_SAMA7G54-PIO (R383.1), 08_SOM_USB_CARD (U42.5)
SOM_MRAM_QSPI_IO1: 08_SAMA7G54-PIO (R382.1), 08_SOM_USB_CARD (U42.2)
SOM_MRAM_QSPI_IO2: 08_SAMA7G54-PIO (R380.1), 08_SOM_USB_CARD (U42.3)
SOM_MRAM_QSPI_IO3: 08_SAMA7G54-PIO (R378.1), 08_SOM_USB_CARD (U42.7)
SOM_OBC_I2C9_SCL: 05_CONNECTOR_IN (J2.6 R60.2), 08_SAMA7G54-PIO (R595.1)
SOM_OBC_I2C9_SDA: 05_CONNECTOR_IN (J2.5 R38.2), 08_SAMA7G54-PIO (R594.1)
SOM_PRAM_nCS: 08_SAMA7G54-PIO (R582.1), 13_MRAM_RTC_WDT (R454.1 U71.3)
SOM_PRAM_SPI_MISO: 08_SAMA7G54-PIO (R580.1), 13_MRAM_RTC_WDT (U71.13)
SOM_PRAM_SPI_MOSI: 08_SAMA7G54-PIO (R579.1), 13_MRAM_RTC_WDT (U71.10)
SOM_PRAM_SPI_SCK: 08_SAMA7G54-PIO (R581.1), 13_MRAM_RTC_WDT (U71.6)
SOM_RAM_QSPI_nCS: 08_SAMA7G54-PIO (R384.1), 08_SOM_USB_CARD (R351.2)
SOM_RS422_RX: 05_CONNECTOR_IN (R14.2), 08_SAMA7G54-PIO (R601.1)
SOM_RS422_TX: 05_CONNECTOR_IN (R15.2), 08_SAMA7G54-PIO (R599.1)
SOM_SDMMC0_CD_PA14: 08_SAMA7G54-PIO (R509.1), 09_eMMC (R201.1)
SOM_SDMMC0_OUT_CK: 08_SAMA7G54-PIO (R355.1), 09_eMMC (R242.1 U23.P6)
SOM_SDMMC0_OUT_CMD: 08_SAMA7G54-PIO (R357.1), 09_eMMC (R241.1 U23.P5)
SOM_SDMMC0_OUT_D0: 08_SAMA7G54-PIO (R363.1), 09_eMMC (R240.1 U23.K2)
SOM_SDMMC0_OUT_D1: 08_SAMA7G54-PIO (R365.1), 09_eMMC (R239.1 U23.N2)
SOM_SDMMC0_OUT_D2: 08_SAMA7G54-PIO (R368.1), 09_eMMC (R238.1 U23.K3)
SOM_SDMMC0_OUT_D3: 08_SAMA7G54-PIO (R371.1), 09_eMMC (R237.1 U23.N3)
SOM_SDMMC0_OUT_D4: 08_SAMA7G54-PIO (R373.1), 09_eMMC (R236.1 U23.N8)
SOM_SDMMC0_OUT_D5: 08_SAMA7G54-PIO (R375.1), 09_eMMC (R235.1 U23.K8)
SOM_SDMMC0_OUT_D6: 08_SAMA7G54-PIO (R377.1), 09_eMMC (R234.1 U23.N9)
SOM_SDMMC0_OUT_D7: 08_SAMA7G54-PIO (R379.1), 09_eMMC (R233.1 U23.K9)
SOM_SDMMC0_OUT_DS: 08_SAMA7G54-PIO (R381.1), 09_eMMC (U23.K5)
SOM_USB_LED_1: 08_SAMA7G54-PIO (R532.1), 10_USB (R113.1)
SOM_USB_LED_2: 08_SAMA7G54-PIO (R578.1), 10_USB (R118.1)
SOM_USER_BUTTON_PA12: 08_SAMA7G54-MPU (R507.1), 08_SAMA7G54-PIO (R508.1)
TEC_ADC_1: 16_TEC (U6.20), ANA_SWITCH (U57.2)
TEC_ADC_2: 16_TEC (U8.20), ANA_SWITCH (U57.3)
TEC_ADC_3: 16_TEC (U7.20), ANA_SWITCH (U57.4)
TEC_ADC_4: 16_TEC (U9.20), ANA_SWITCH (U57.5)
TEC_nCS_1: 11_MCU (R95.2), 16_TEC (R124.2 U6.15)
TEC_nCS_2: 11_MCU (R98.2), 16_TEC (R134.2 U8.15)
TEC_nCS_3: 11_MCU (R100.2), 16_TEC (R125.2 U7.15)
TEC_nCS_4: 11_MCU (R29.1), 16_TEC (R135.2 U9.15)
TEC_SWEN_1: 11_MCU (R58.2), 16_TEC (R130.1 U6.13)
TEC_SWEN_2: 11_MCU (R33.1), 16_TEC (R140.1 U8.13)
TEC_SWEN_3: 11_MCU (R64.2), 16_TEC (R132.1 U7.13)
TEC_SWEN_4: 11_MCU (R66.2), 16_TEC (R142.1 U9.13)
TEMP _SENSOR: 11_MCU (R281.1), 14_NTC_TEMPSENSOR (U15.2)
USB_1_PWR_EN: 08_SAMA7G54-PIO (R356.1), 10_USB (R123.1 U5.1)
USB_1_PWR_nFAIL: 08_SAMA7G54-PIO (R358.1), 10_USB (U5.2)
USB_2_PWR_EN: 08_SAMA7G54-PIO (R390.1), 10_USB (R122.1 U5.4)
USB_2_PWR_nFAIL: 08_SAMA7G54-PIO (R361.1), 10_USB (U5.3)
USBA_N: 08_SAMA7G54-MPU (U29.B3), 12_CONSOLE (U32.3)
USBA_P: 08_SAMA7G54-MPU (U29.A3), 12_CONSOLE (U32.4)
USBB_N: 08_SAMA7G54-MPU (U29.B4), 20_AI_Board (J20.7)
USBB_P: 08_SAMA7G54-MPU (U29.A4), 20_AI_Board (J20.8)
USBC_N: 08_SAMA7G54-MPU (U29.B6), 10_USB (U4.30)
USBC_P: 08_SAMA7G54-MPU (U29.A6), 10_USB (U4.31)
WKUP: 08_SAMA7G54-MPU (U29.AA15), 08_SAMA7G54-PMIC (R339.1 U51.7)